# EAGLE design SPI_Test_2xMCUs (EAGLE 9.6.2)
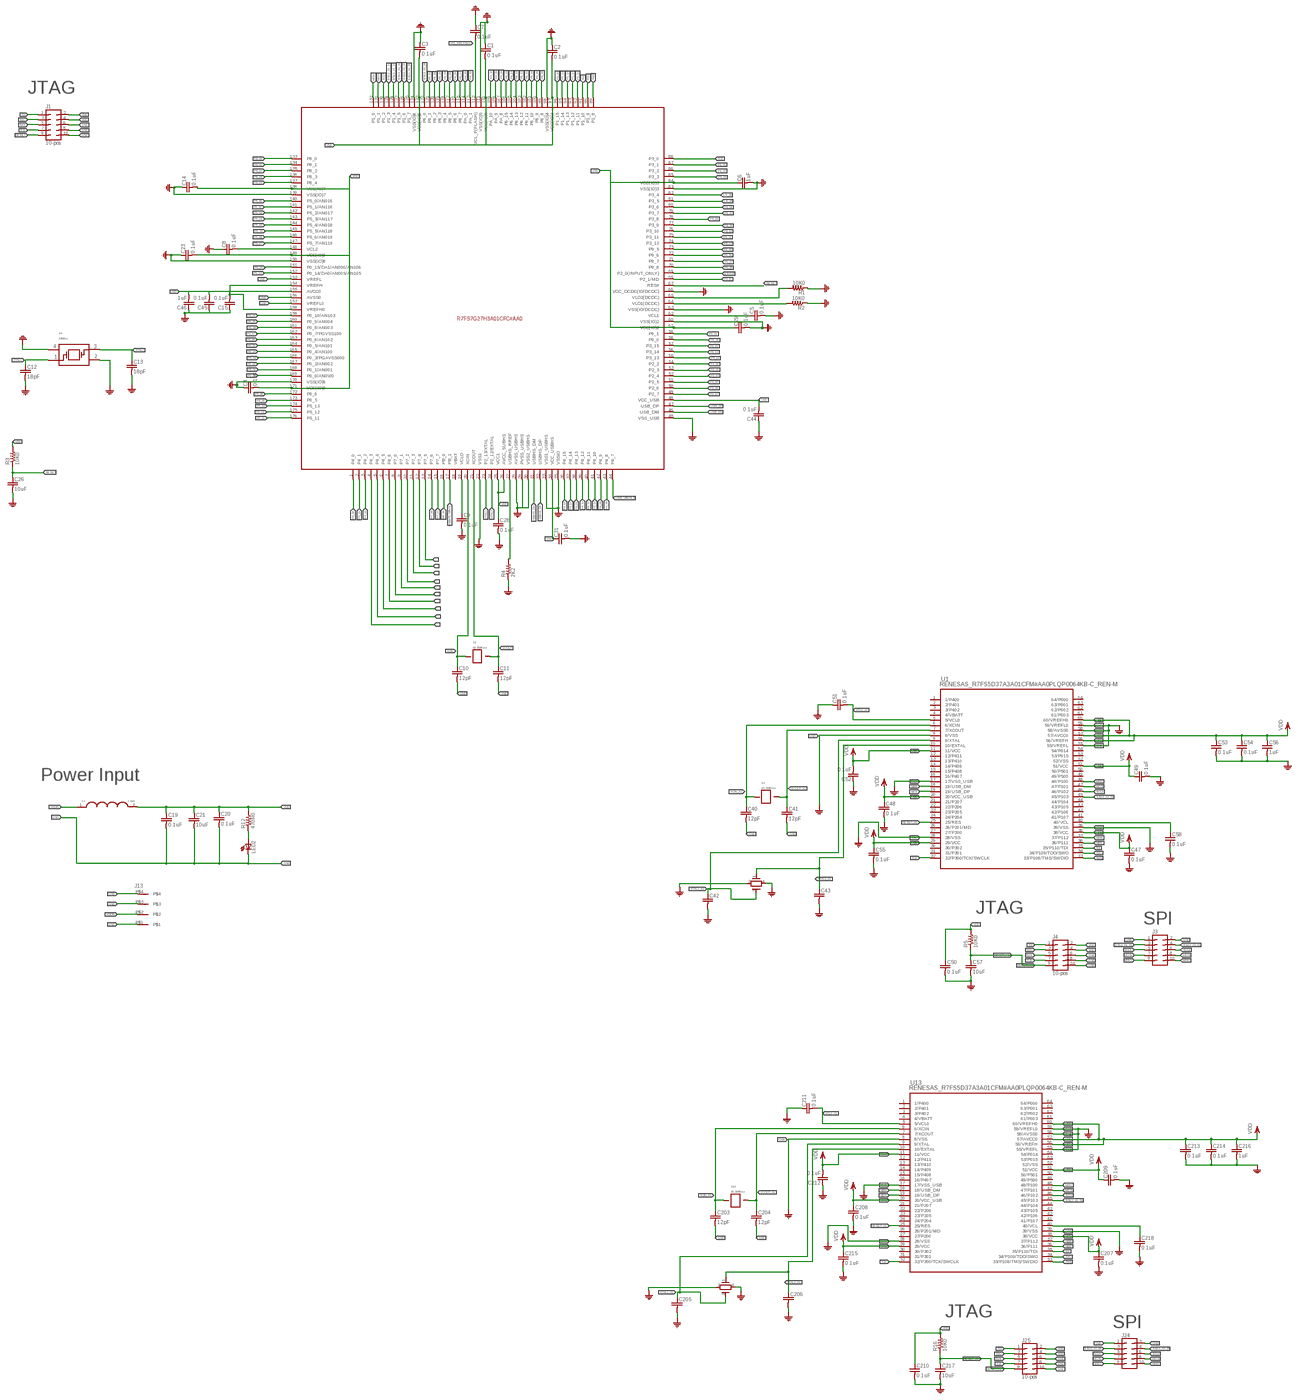
[diagram p0: schematic, sheet 1, overview]
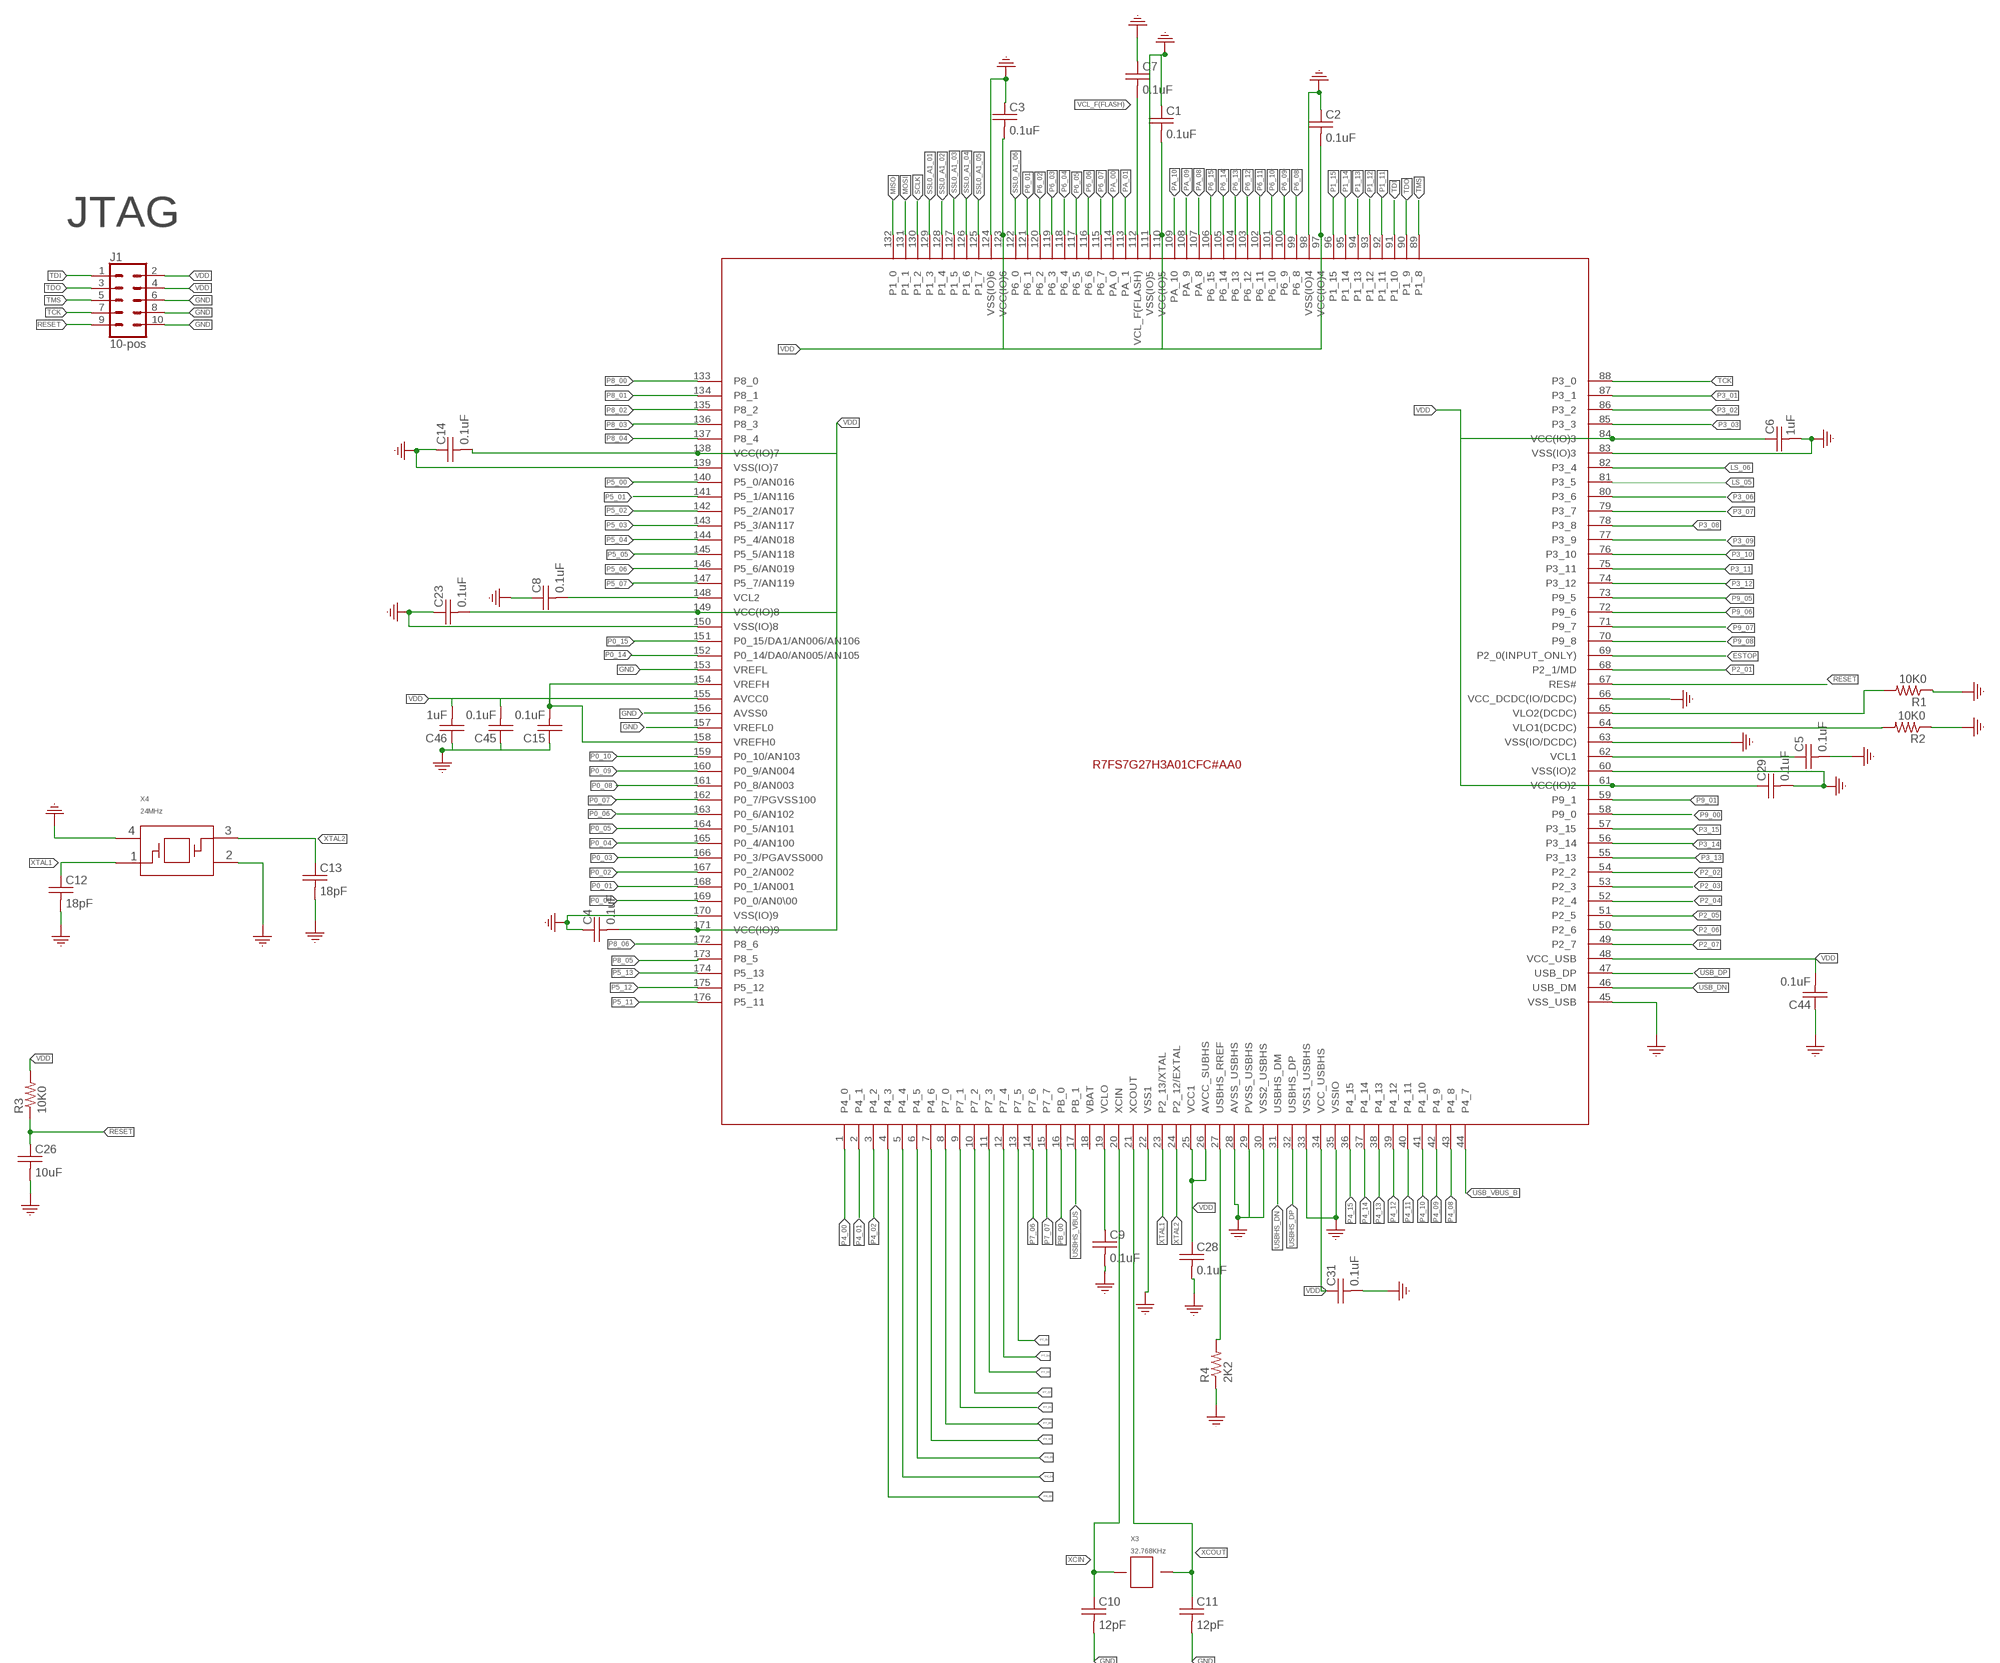
[diagram p1: schematic, sheet 1, part 1 of 4]
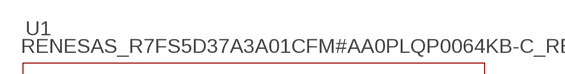
[diagram p2: schematic, sheet 1, part 2 of 4]
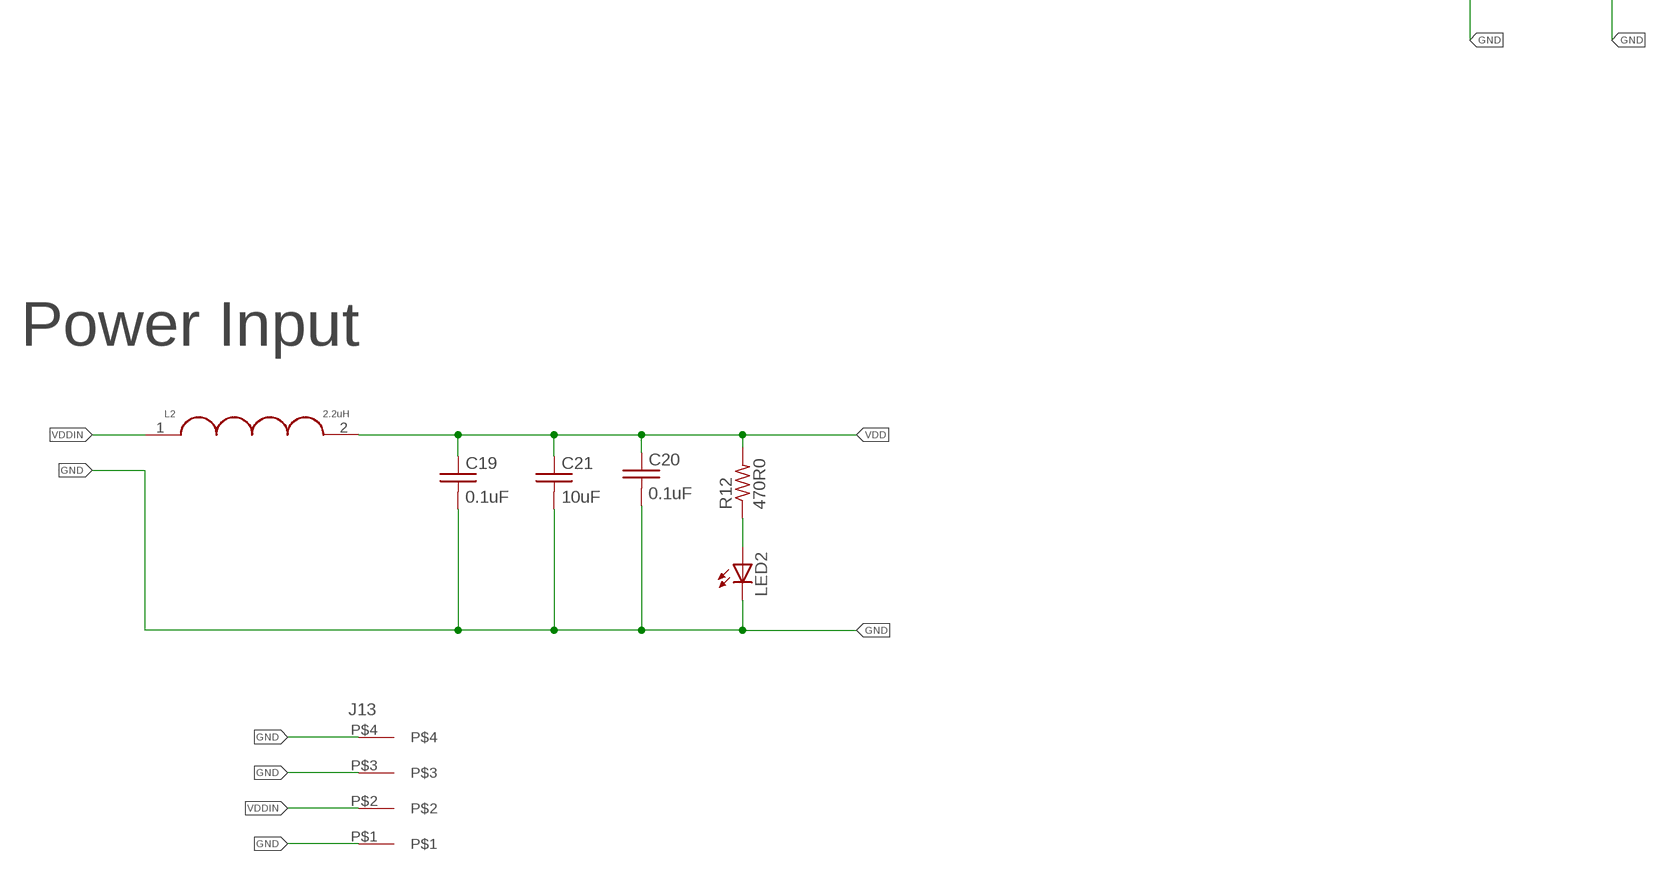
[diagram p3: schematic, sheet 1, part 3 of 4]
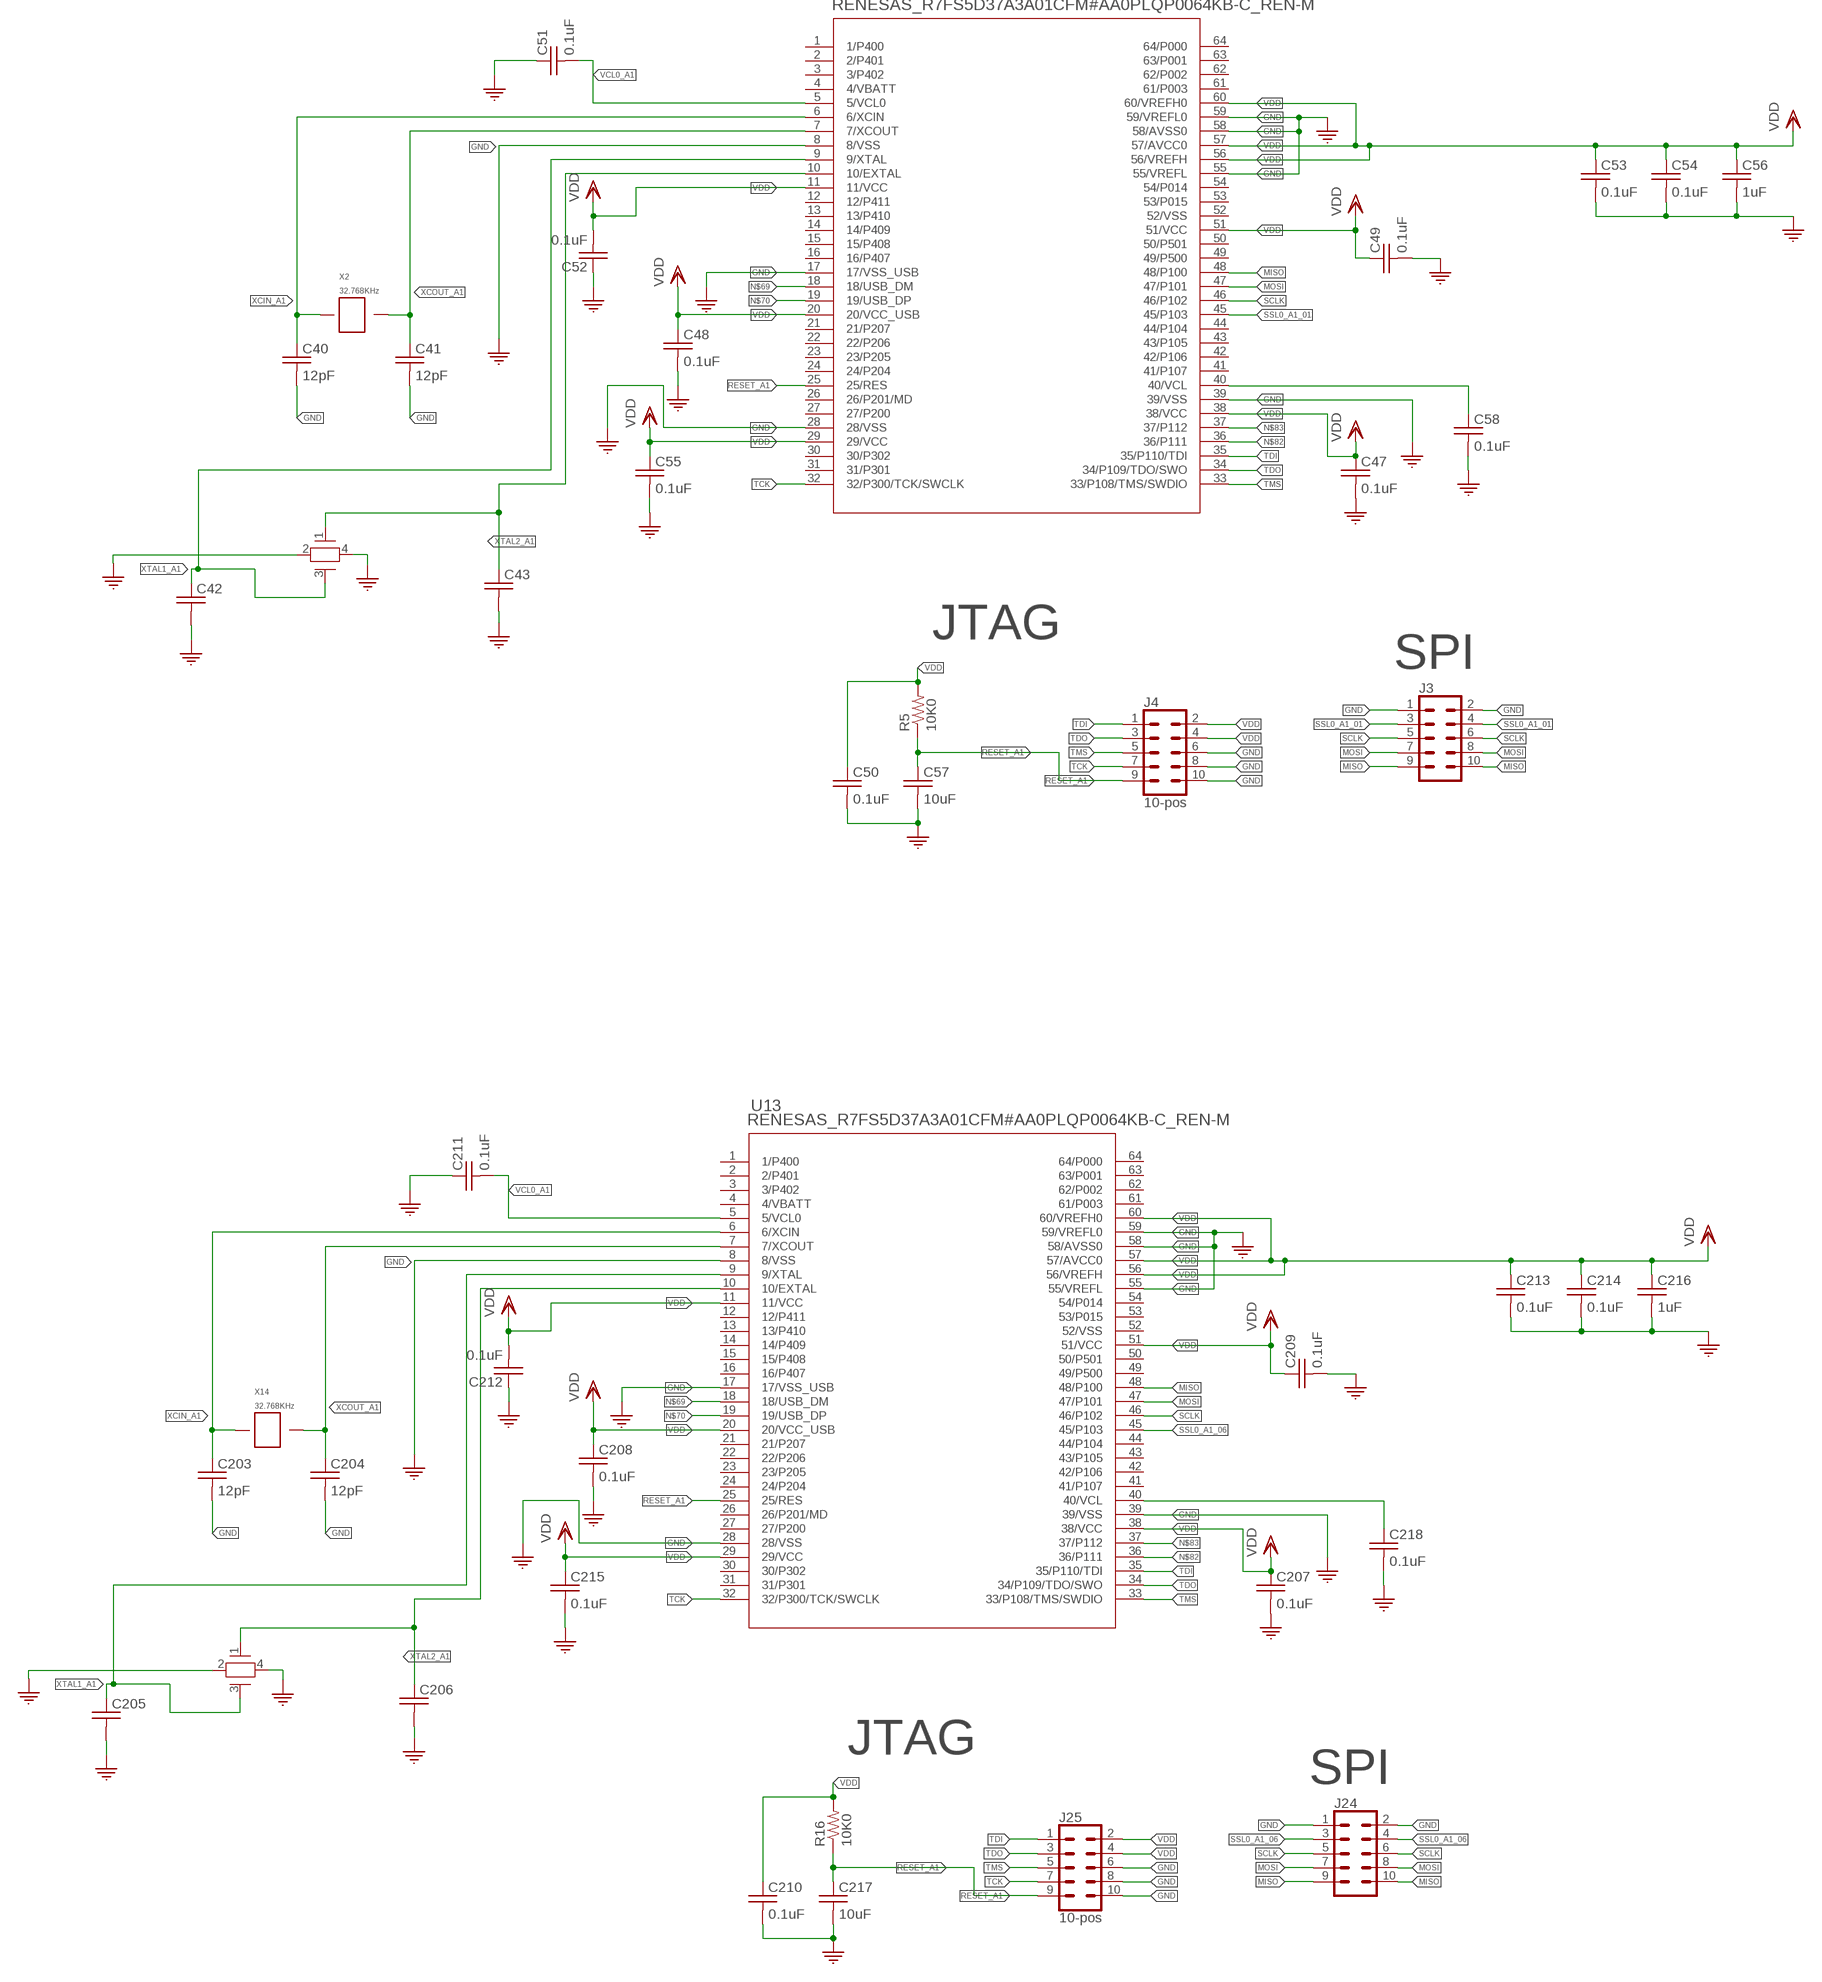
[diagram p4: schematic, sheet 1, part 4 of 4]

## Parts
C1  0.1uF  C_0402_0.1UF  [0402]
C2  0.1uF  C_0402_0.1UF  [0402]
C3  0.1uF  C_0402_0.1UF  [0402]
C4  0.1uF  C_0402_0.1UF  [0402]
C5  0.1uF  C_0402_0.1UF  [0402]
C6  1uF  C_0402_1UF  [0402]
C7  0.1uF  C_0402_0.1UF  [0402]
C8  0.1uF  C_0402_0.1UF  [0402]
C9  0.1uF  C_0402_0.1UF  [0402]
C10  12pF  C_0402_12PF  [0402]
C11  12pF  C_0402_12PF  [0402]
C12  18pF  C_0402_18PF  [0402]
C13  18pF  C_0402_18PF  [0402]
C14  0.1uF  C_0402_0.1UF  [0402]
C15  0.1uF  C_0402_0.1UF  [0402]
C19  0.1uF  C_0402_0.1UF  [0402]
C20  0.1uF  C_0402_0.1UF  [0402]
C21  10uF  C_0402_10UF  [0402]
C23  0.1uF  C_0402_0.1UF  [0402]
C26  10uF  C_0402_10UF  [0402]
C28  0.1uF  C_0402_0.1UF  [0402]
C29  0.1uF  C_0402_0.1UF  [0402]
C31  0.1uF  C_0402_0.1UF  [0402]
C40  12pF  C_0402_12PF  [0402]
C41  12pF  C_0402_12PF  [0402]
C42  10pF  C_0402_10PF  [0402]
C43  10pF  C_0402_10PF  [0402]
C44  0.1uF  C_0402_0.1UF  [0402]
C45  0.1uF  C_0402_0.1UF  [0402]
C46  1uF  C_0402_1UF  [0402]
C47  0.1uF  C_0402_0.1UF  [0402]
C48  0.1uF  C_0402_0.1UF  [0402]
C49  0.1uF  C_0402_0.1UF  [0402]
C50  0.1uF  C_0402_0.1UF  [0402]
C51  0.1uF  C_0402_0.1UF  [0402]
C52  0.1uF  C_0402_0.1UF  [0402]
C53  0.1uF  C_0402_0.1UF  [0402]
C54  0.1uF  C_0402_0.1UF  [0402]
C55  0.1uF  C_0402_0.1UF  [0402]
C56  1uF  C_0402_1UF  [0402]
C57  10uF  C_0402_10UF  [0402]
C58  0.1uF  C_0402_0.1UF  [0402]
C203  12pF  C_0402_12PF  [0402]
C204  12pF  C_0402_12PF  [0402]
C205  10pF  C_0402_10PF  [0402]
C206  10pF  C_0402_10PF  [0402]
C207  0.1uF  C_0402_0.1UF  [0402]
C208  0.1uF  C_0402_0.1UF  [0402]
C209  0.1uF  C_0402_0.1UF  [0402]
C210  0.1uF  C_0402_0.1UF  [0402]
C211  0.1uF  C_0402_0.1UF  [0402]
C212  0.1uF  C_0402_0.1UF  [0402]
C213  0.1uF  C_0402_0.1UF  [0402]
C214  0.1uF  C_0402_0.1UF  [0402]
C215  0.1uF  C_0402_0.1UF  [0402]
C216  1uF  C_0402_1UF  [0402]
C217  10uF  C_0402_10UF  [0402]
C218  0.1uF  C_0402_0.1UF  [0402]
J1  10-pos  CONN_05X2_RAPTH  [2X5]
J3  CONN_05X2PTH  [2X5]
J4  10-pos  CONN_05X2_RAPTH  [2X5]
J13  4-pos  3.81MM_1_X_4_RT_ANGLE_PLUG_HEADER  [1X4_3.81MM_PITCH]
J24  CONN_05X2PTH  [2X5]
J25  10-pos  CONN_05X2_RAPTH  [2X5]
L2  2.2uH  INDUCTOR_1008_2.2_MH_1.3A  [1008]
LED2  Green  LED_0805_GREEN  [0805]
R1  10K0  R_0402_10K0  [0402]
R2  10K0  R_0402_10K0  [0402]
R3  10K0  R_0402_10K0  [0402]
R4  2K2  R_0402_2K2  [0402]
R5  10K0  R_0402_10K0  [0402]
R12  470R0  R_0402_470R0  [0402]
R16  10K0  R_0402_10K0  [0402]
U1  RENESAS_R7FS5D37A3A01CFM#AA0PLQP0064KB-C_REN-M  [PLQP0064KB-C_REN-M]
U2  S7G2LQFP176  RENESAS_S7G2_X_176  [LQFP176_24X24]
U13  RENESAS_R7FS5D37A3A01CFM#AA0PLQP0064KB-C_REN-M  [PLQP0064KB-C_REN-M]
X2  32.768KHz  XTAL_32.768KHZ  [SMD_X_2_PADS]
X3  32.768KHz  XTAL_32.768KHZ  [SMD_X_2_PADS]
X4  24MHz  XTAL_24_MHZ  [SMD_3225]
X14  32.768KHz  XTAL_32.768KHZ  [SMD_X_2_PADS]
Y1  XTAL_12MHZ_ABM8G-12.000MHZ-B4Y-T  [CRYSTAL_ABM8G_ABR]
Y12  XTAL_12MHZ_ABM8G-12.000MHZ-B4Y-T  [CRYSTAL_ABM8G_ABR]

## Nets
ESTOP: U2.69(P2_0(INPUT_ONLY))
GND: C1.P$1 C2.P$1 C3.P$1 C4.P$1 C5.P$2 C6.P$2 C7.P$1 C8.P$1 C9.P$2 C10.P$2 C11.P$2 C12.P$2 C13.P$2 C14.P$1 C15.P$1 C19.P$2 C20.P$2 C21.P$2 C23.P$1 C26.P$2 C28.P$2 C29.P$2 C31.P$2 C40.P$2 C41.P$2 C42.P$2 C43.P$2 C44.P$1 C45.P$1 C46.P$1 C47.P$2 C48.P$2 C49.P$2 C50.P$2 C51.P$1 C52.P$1 C53.P$2 C54.P$2 C55.P$2 C56.P$2 C57.P$2 C58.P$2 C203.P$2 C204.P$2 C205.P$2 C206.P$2 C207.P$2 C208.P$2 C209.P$2 C210.P$2 C211.P$1 C212.P$1 C213.P$2 C214.P$2 C215.P$2 C216.P$2 C217.P$2 C218.P$2 J1.6 J1.8 J1.10 J3.1 J3.2 J4.6 J4.8 J4.10 J13.P$1 J13.P$3 J13.P$4 J24.1 J24.2 J25.6 J25.8 J25.10 LED2.2(C) R1.P$1 R2.P$1 R4.P$1 U1.8(8/VSS) U1.17(17/VSS_USB) U1.28(28/VSS) U1.39(39/VSS) U1.55(55/VREFL) U1.58(58/AVSS0) U1.59(59/VREFL0) U2.22(VSS1) U2.28(AVSS_USBHS) U2.29(PVSS_USBHS) U2.30(VSS2_USBHS) U2.33(VSS1_USBHS) U2.35(VSSIO) U2.45(VSS_USB) U2.60(VSS(IO)2) U2.63(VSS(IO/DCDC)) U2.66(VCC_DCDC(IO/DCDC)) U2.83(VSS(IO)3) U2.98(VSS(IO)4) U2.111(VSS(IO)5) U2.124(VSS(IO)6) U2.139(VSS(IO)7) U2.150(VSS(IO)8) U2.153(VREFL) U2.156(AVSS0) U2.157(VREFL0) U2.170(VSS(IO)9) U13.8(8/VSS) U13.17(17/VSS_USB) U13.28(28/VSS) U13.39(39/VSS) U13.55(55/VREFL) U13.58(58/AVSS0) U13.59(59/VREFL0) X4.2 X4.4 Y1.2 Y1.4 Y12.2 Y12.4
LS_05: U2.81(P3_5)
LS_06: U2.82(P3_4)
MISO: J3.9 J3.10 J24.9 J24.10 U1.48(48/P100) U2.132(P1_0) U13.48(48/P100)
MOSI: J3.7 J3.8 J24.7 J24.8 U1.47(47/P101) U2.131(P1_1) U13.47(47/P101)
N$2: C8.P$2 U2.148(VCL2)
N$3: C9.P$1 U2.19(VCLO)
N$4: LED2.1(A) R12.P$1
N$5: C58.P$1 U1.40(40/VCL)
N$9: C5.P$1 U2.62(VCL1)
N$10: R2.P$2 U2.64(VLO1(DCDC))
N$11: R1.P$2 U2.65(VLO2(DCDC))
N$12: R4.P$2 U2.27(USBHS_RREF)
N$19: C218.P$1 U13.40(40/VCL)
N$69: U1.18(18/USB_DM) U13.18(18/USB_DM)
N$70: U1.19(19/USB_DP) U13.19(19/USB_DP)
N$82: U1.36(36/P111) U13.36(36/P111)
N$83: U1.37(37/P112) U13.37(37/P112)
P0_00: U2.169(P0_0/AN0\00)
P0_01: U2.168(P0_1/AN001)
P0_02: U2.167(P0_2/AN002)
P0_03: U2.166(P0_3/PGAVSS000)
P0_04: U2.165(P0_4/AN100)
P0_05: U2.164(P0_5/AN101)
P0_06: U2.163(P0_6/AN102)
P0_07: U2.162(P0_7/PGVSS100)
P0_08: U2.161(P0_8/AN003)
P0_09: U2.160(P0_9/AN004)
P0_10: U2.159(P0_10/AN103)
P0_14: U2.152(P0_14/DA0/AN005/AN105)
P0_15: U2.151(P0_15/DA1/AN006/AN106)
P1_11: U2.92(P1_11)
P1_12: U2.93(P1_12)
P1_13: U2.94(P1_13)
P1_14: U2.95(P1_14)
P1_15: U2.96(P1_15)
P2_01: U2.68(P2_1/MD)
P2_02: U2.54(P2_2)
P2_03: U2.53(P2_3)
P2_04: U2.52(P2_4)
P2_05: U2.51(P2_5)
P2_06: U2.50(P2_6)
P2_07: U2.49(P2_7)
P3_01: U2.87(P3_1)
P3_02: U2.86(P3_2)
P3_03: U2.85(P3_3)
P3_06: U2.80(P3_6)
P3_07: U2.79(P3_7)
P3_08: U2.78(P3_8)
P3_09: U2.77(P3_9)
P3_10: U2.76(P3_10)
P3_11: U2.75(P3_11)
P3_12: U2.74(P3_12)
P3_13: U2.55(P3_13)
P3_14: U2.56(P3_14)
P3_15: U2.57(P3_15)
P4_00: U2.1(P4_0)
P4_01: U2.2(P4_1)
P4_02: U2.3(P4_2)
P4_03: U2.4(P4_3)
P4_04: U2.5(P4_4)
P4_05: U2.6(P4_5)
P4_06: U2.7(P4_6)
P4_08: U2.43(P4_8)
P4_09: U2.42(P4_9)
P4_10: U2.41(P4_10)
P4_11: U2.40(P4_11)
P4_12: U2.39(P4_12)
P4_13: U2.38(P4_13)
P4_14: U2.37(P4_14)
P4_15: U2.36(P4_15)
P5_00: U2.140(P5_0/AN016)
P5_01: U2.141(P5_1/AN116)
P5_02: U2.142(P5_2/AN017)
P5_03: U2.143(P5_3/AN117)
P5_04: U2.144(P5_4/AN018)
P5_05: U2.145(P5_5/AN118)
P5_06: U2.146(P5_6/AN019)
P5_07: U2.147(P5_7/AN119)
P5_11: U2.176(P5_11)
P5_12: U2.175(P5_12)
P5_13: U2.174(P5_13)
P6_01: U2.121(P6_1)
P6_02: U2.120(P6_2)
P6_03: U2.119(P6_3)
P6_04: U2.118(P6_4)
P6_05: U2.117(P6_5)
P6_06: U2.116(P6_6)
P6_07: U2.115(P6_7)
P6_08: U2.99(P6_8)
P6_09: U2.100(P6_9)
P6_10: U2.101(P6_10)
P6_11: U2.102(P6_11)
P6_12: U2.103(P6_12)
P6_13: U2.104(P6_13)
P6_14: U2.105(P6_14)
P6_15: U2.106(P6_15)
P7_00: U2.8(P7_0)
P7_01: U2.9(P7_1)
P7_02: U2.10(P7_2)
P7_03: U2.11(P7_3)
P7_04: U2.12(P7_4)
P7_05: U2.13(P7_5)
P7_06: U2.14(P7_6)
P7_07: U2.15(P7_7)
P8_00: U2.133(P8_0)
P8_01: U2.134(P8_1)
P8_02: U2.135(P8_2)
P8_03: U2.136(P8_3)
P8_04: U2.137(P8_4)
P8_05: U2.173(P8_5)
P8_06: U2.172(P8_6)
P9_00: U2.58(P9_0)
P9_01: U2.59(P9_1)
P9_05: U2.73(P9_5)
P9_06: U2.72(P9_6)
P9_07: U2.71(P9_7)
P9_08: U2.70(P9_8)
PA_00: U2.114(PA_0)
PA_01: U2.113(PA_1)
PA_08: U2.107(PA_8)
PA_09: U2.108(PA_9)
PA_10: U2.109(PA_10)
PB_00: U2.16(PB_0)
RESET: C26.P$1 J1.9 R3.P$1 U2.67(RES#)
RESET_A1: C57.P$1 C217.P$1 J4.9 J25.9 R5.P$1 R16.P$1 U1.25(25/RES) U13.25(25/RES)
SCLK: J3.5 J3.6 J24.5 J24.6 U1.46(46/P102) U2.130(P1_2) U13.46(46/P102)
SSL0_A1_01: J3.3 J3.4 U1.45(45/P103) U2.129(P1_3)
SSL0_A1_02: U2.128(P1_4)
SSL0_A1_03: U2.127(P1_5)
SSL0_A1_04: U2.126(P1_6)
SSL0_A1_05: U2.125(P1_7)
SSL0_A1_06: J24.3 J24.4 U2.122(P6_0) U13.45(45/P103)
TCK: J1.7 J4.7 J25.7 U1.32(32/P300/TCK/SWCLK) U2.88(P3_0) U13.32(32/P300/TCK/SWCLK)
TDI: J1.1 J4.1 J25.1 U1.35(35/P110/TDI) U2.91(P1_10) U13.35(35/P110/TDI)
TDO: J1.3 J4.3 J25.3 U1.34(34/P109/TDO/SWO) U2.90(P1_9) U13.34(34/P109/TDO/SWO)
TMS: J1.5 J4.5 J25.5 U1.33(33/P108/TMS/SWDIO) U2.89(P1_8) U13.33(33/P108/TMS/SWDIO)
USB_DN [USB_DIFF_PAIR]: U2.46(USB_DM)
USB_DP [USB_DIFF_PAIR]: U2.47(USB_DP)
USB_VBUS_B: U2.44(P4_7)
USBHS_DN: U2.31(USBHS_DM)
USBHS_DP: U2.32(USBHS_DP)
USBHS_VBUS: U2.17(PB_1)
VCL0_A1: C51.P$2 C211.P$2 U1.5(5/VCL0) U13.5(5/VCL0)
VCL_F(FLASH): C7.P$2 U2.112(VCL_F(FLASH))
VDD: C1.P$2 C2.P$2 C3.P$2 C4.P$2 C6.P$1 C14.P$2 C15.P$2 C19.P$1 C20.P$1 C21.P$1 C23.P$2 C28.P$1 C29.P$1 C31.P$1 C44.P$2 C45.P$2 C46.P$2 C47.P$1 C48.P$1 C49.P$1 C50.P$1 C52.P$2 C53.P$1 C54.P$1 C55.P$1 C56.P$1 C207.P$1 C208.P$1 C209.P$1 C210.P$1 C212.P$2 C213.P$1 C214.P$1 C215.P$1 C216.P$1 J1.2 J1.4 J4.2 J4.4 J25.2 J25.4 L2.2 R3.P$2 R5.P$2 R12.P$2 R16.P$2 U1.11(11/VCC) U1.20(20/VCC_USB) U1.29(29/VCC) U1.38(38/VCC) U1.51(51/VCC) U1.56(56/VREFH) U1.57(57/AVCC0) U1.60(60/VREFH0) U2.25(VCC1) U2.26(AVCC_SUBHS) U2.34(VCC_USBHS) U2.48(VCC_USB) U2.61(VCC(IO)2) U2.84(VCC(IO)3) U2.97(VCC(IO)4) U2.110(VCC(IO)5) U2.123(VCC(IO)6) U2.138(VCC(IO)7) U2.149(VCC(IO)8) U2.154(VREFH) U2.155(AVCC0) U2.158(VREFH0) U2.171(VCC(IO)9) U13.11(11/VCC) U13.20(20/VCC_USB) U13.29(29/VCC) U13.38(38/VCC) U13.51(51/VCC) U13.56(56/VREFH) U13.57(57/AVCC0) U13.60(60/VREFH0)
VDDIN: J13.P$2 L2.1
XCIN: C10.P$1 U2.20(XCIN) X3.P$1
XCIN_A1: C40.P$1 C203.P$1 U1.6(6/XCIN) U13.6(6/XCIN) X2.P$1 X14.P$1
XCOUT: C11.P$1 U2.21(XCOUT) X3.P$2
XCOUT_A1: C41.P$1 C204.P$1 U1.7(7/XCOUT) U13.7(7/XCOUT) X2.P$2 X14.P$2
XTAL1: C12.P$1 U2.23(P2_13/XTAL) X4.1
XTAL1_A1: C42.P$1 C205.P$1 U1.9(9/XTAL) U13.9(9/XTAL) Y1.3 Y12.3
XTAL2: C13.P$1 U2.24(P2_12/EXTAL) X4.3
XTAL2_A1: C43.P$1 C206.P$1 U1.10(10/EXTAL) U13.10(10/EXTAL) Y1.1 Y12.1
Unconnected: U1.1(1/P400) U1.2(2/P401) U1.3(3/P402) U1.12(12/P411) U1.13(13/P410) U1.14(14/P409) U1.15(15/P408) U1.16(16/P407) U1.22(22/P206) U1.23(23/P205) U1.24(24/P204) U1.26(26/P201/MD) U1.27(27/P200) U1.30(30/P302) U1.31(31/P301) U1.41(41/P107) U1.42(42/P106) U1.43(43/P105) U1.44(44/P104) U1.49(49/P500) U1.50(50/P501) U1.52(52/VSS) U1.53(53/P015) U1.54(54/P014) U1.61(61/P003) U1.62(62/P002) U1.63(63/P001) U1.64(64/P000) U2.18(VBAT) U13.1(1/P400) U13.2(2/P401) U13.3(3/P402) U13.12(12/P411) U13.13(13/P410) U13.14(14/P409) U13.15(15/P408) U13.16(16/P407) U13.22(22/P206) U13.23(23/P205) U13.24(24/P204) U13.26(26/P201/MD) U13.27(27/P200) U13.30(30/P302) U13.31(31/P301) U13.41(41/P107) U13.42(42/P106) U13.43(43/P105) U13.44(44/P104) U13.49(49/P500) U13.50(50/P501) U13.52(52/VSS) U13.53(53/P015) U13.54(54/P014) U13.61(61/P003) U13.62(62/P002) U13.63(63/P001) U13.64(64/P000)

## Notes on the sheet
- JTAG
- Power Input
- JTAG
- SPI
- JTAG
- SPI

## Power pins joined to a net without a drawn wire
4/VBATT: U1.4(4/VBATT) U13.4(4/VBATT)
21/P207: U1.21(21/P207) U13.21(21/P207)

## Library data of the parts
C1-C5 C7-C9 C14 C15 C19 C20 C23 C28 C29 C31 C44 C45 C47-C55 C58 C207-C215 C218 = 3D_MIG_Controller:C_0402_0.1UF; PARTNO: CL05F104ZO5NNNC
C6 C46 C56 C216 = 3D_MIG_Controller:C_0402_1UF; PARTNO: CL05A105KO5NNNC
C10 C11 C40 C41 C203 C204 = 3D_MIG_Controller:C_0402_12PF; PARTNO: CL05C120JB5NNNC
C12 C13 = 3D_MIG_Controller:C_0402_18PF; PARTNO: UMK105CG180JV-F
C21 C26 C57 C217 = 3D_MIG_Controller:C_0402_10UF; PARTNO: CL05A106MP8NUB8
C42 C43 C205 C206 = 3D_MIG_Controller:C_0402_10PF; PARTNO: CC0402JRNPO9BN100
J1 J4 J25 = 3D_MIG_Controller:CONN_05X2_RA: Connector Header Through Hole, Right Angle 10 position 0.100" (2.54mm); PARTNO: PH2RA-10-UA
J3 J24 = 3D_MIG_Controller:CONN_05X2: Multi connection point. Often used as Generic Header-pin footprint for 0.1 inch spaced/style header connections For AVR SPI programming port, see special device with nice symbol: "AVR_SPI_PROG_5x2.dev" You can populate with any combo of single row headers, but if you'd like an exact match, check these: 2x5 AVR ICSP Male Header <https://www.sparkfun.com/products/778> (PRT-00778) 2x5 Pin Shrouded Header <https://www.sparkfun.com/products/8506> (PRT-08506) On any of the 0.1 inch spaced packages, you can populate with these: Break Away Headers - Straight <https://www.sparkfun.com/products/116> (PRT-00116) Break Away Male Headers - Right Angle <https://www.sparkfun.com/products/553> (PRT-00553) Female Headers <https://www.sparkfun.com/products/115> (PRT-00115) Break Away Headers - Machine Pin <https://www.sparkfun.com/products/117> (PRT-00117) Break Away Female Headers - Swiss Machine Pin <https://www.sparkfun.com/products/743> (PRT-00743) Special note: the shrouded connector mates well with our 5x2 ribbon cables: 2x5 Pin IDC Ribbon Cable <https://www.sparkfun.com/products/8535> (PRT-08535); PROD_ID: CONN-08499; SF_ID: PRT-0778
J13 = 3D_MIG_Controller:3.81MM_1_X_4_RT_ANGLE_PLUG_HEADER: 4 Position Terminal Block Header, Male Pins, Shrouded (4 Side) 0.150" (3.81mm) 90°, Right Angle - Through Hole; PARTNO: 691322310004
L2 = 3D_MIG_Controller:INDUCTOR_1008_2.2_MH_1.3A; PARTNO: LQM2HPN2R2MG0L
LED2 = 3D_MIG_Controller:LED_0805_GREEN: Green 570nm LED Indication - Discrete 2.2V 0805 (2012 Metric); PARTNO: LG R971-KN-1
R1-R3 R5 R16 = 3D_MIG_Controller:R_0402_10K0; PARTNO: RMCF0402JT10K0
R4 = 3D_MIG_Controller:R_0402_2K2; PARTNO: RMCF0402JT2K20
R12 = 3D_MIG_Controller:R_0402_470R0; PARTNO: RMCF0402JT470R
U1 U13 = 3D_MIG_Controller:RENESAS_R7FS5D37A3A01CFM#AA0; COPYRIGHT: Copyright (C) 2023 Ultra Librarian. All rights reserved.; MFR_NAME: Renesas Electronics; PARTNO: R7FS3A37A3A01CFM#AA0
U2 = 3D_MIG_Controller:RENESAS_S7G2_X_176; PARTNO: R7FS7G27H3A01CFC#AA0
X2 X3 X14 = 3D_MIG_Controller:XTAL_32.768KHZ; PARTNO: ABS07-32.768KHZ-T
X4 = 3D_MIG_Controller:XTAL_24_MHZ; PARTNO: FA-238 24.0000MB-C3
Y1 Y12 = 3D_MIG_Controller:XTAL_12MHZ_ABM8G-12.000MHZ-B4Y-T; COPYRIGHT: Copyright (C) 2023 Ultra Librarian. All rights reserved.; MFR_NAME: Abracon; PARTNO: ABM8G-12.000MHZ-B4Y-T

## Board
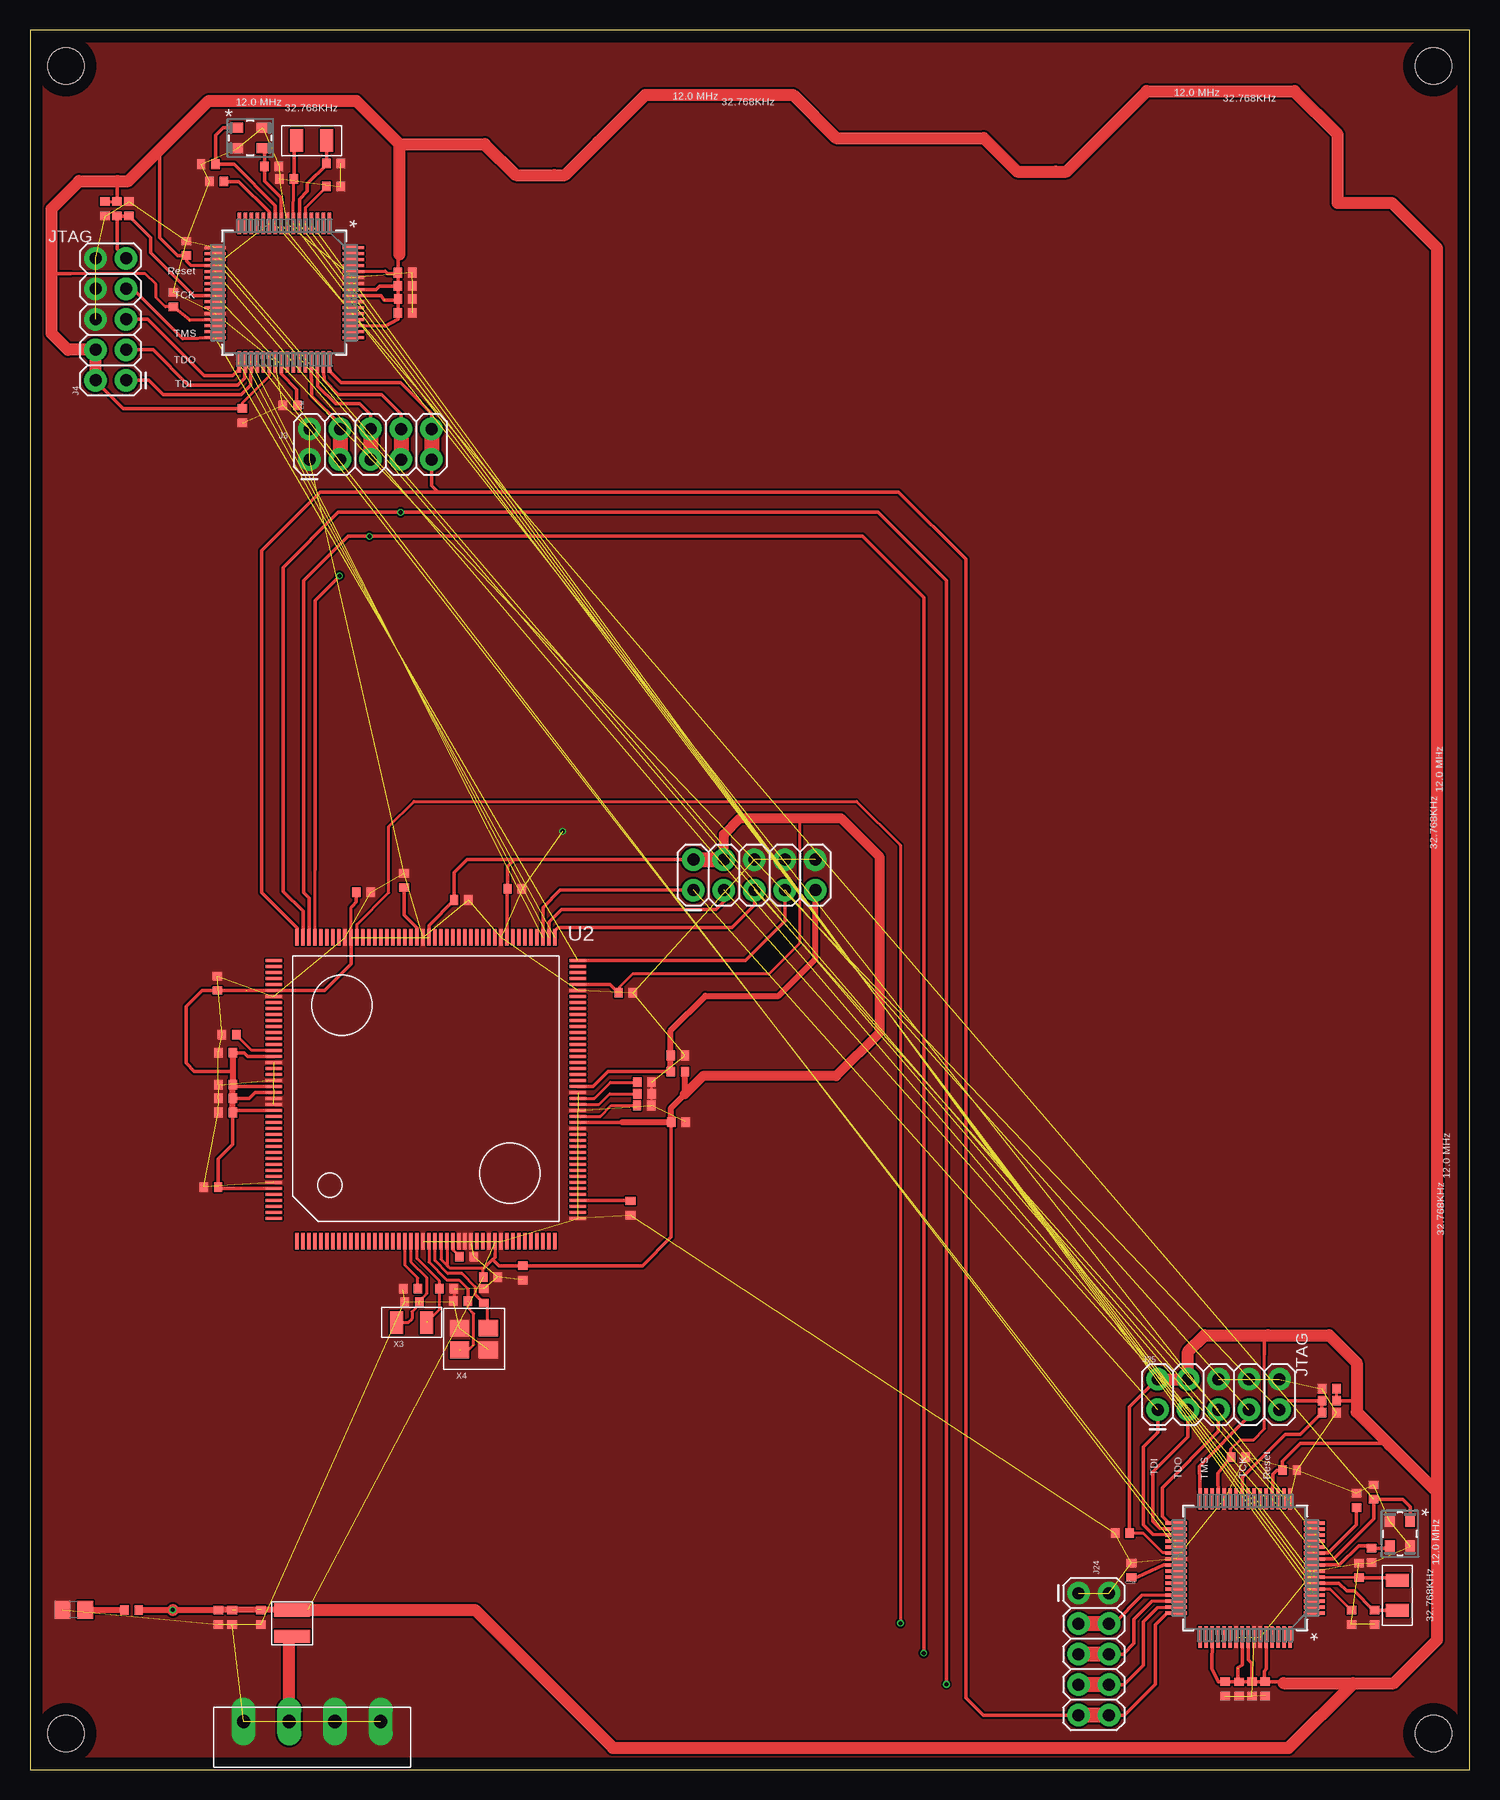
[diagram p5: board, top side]
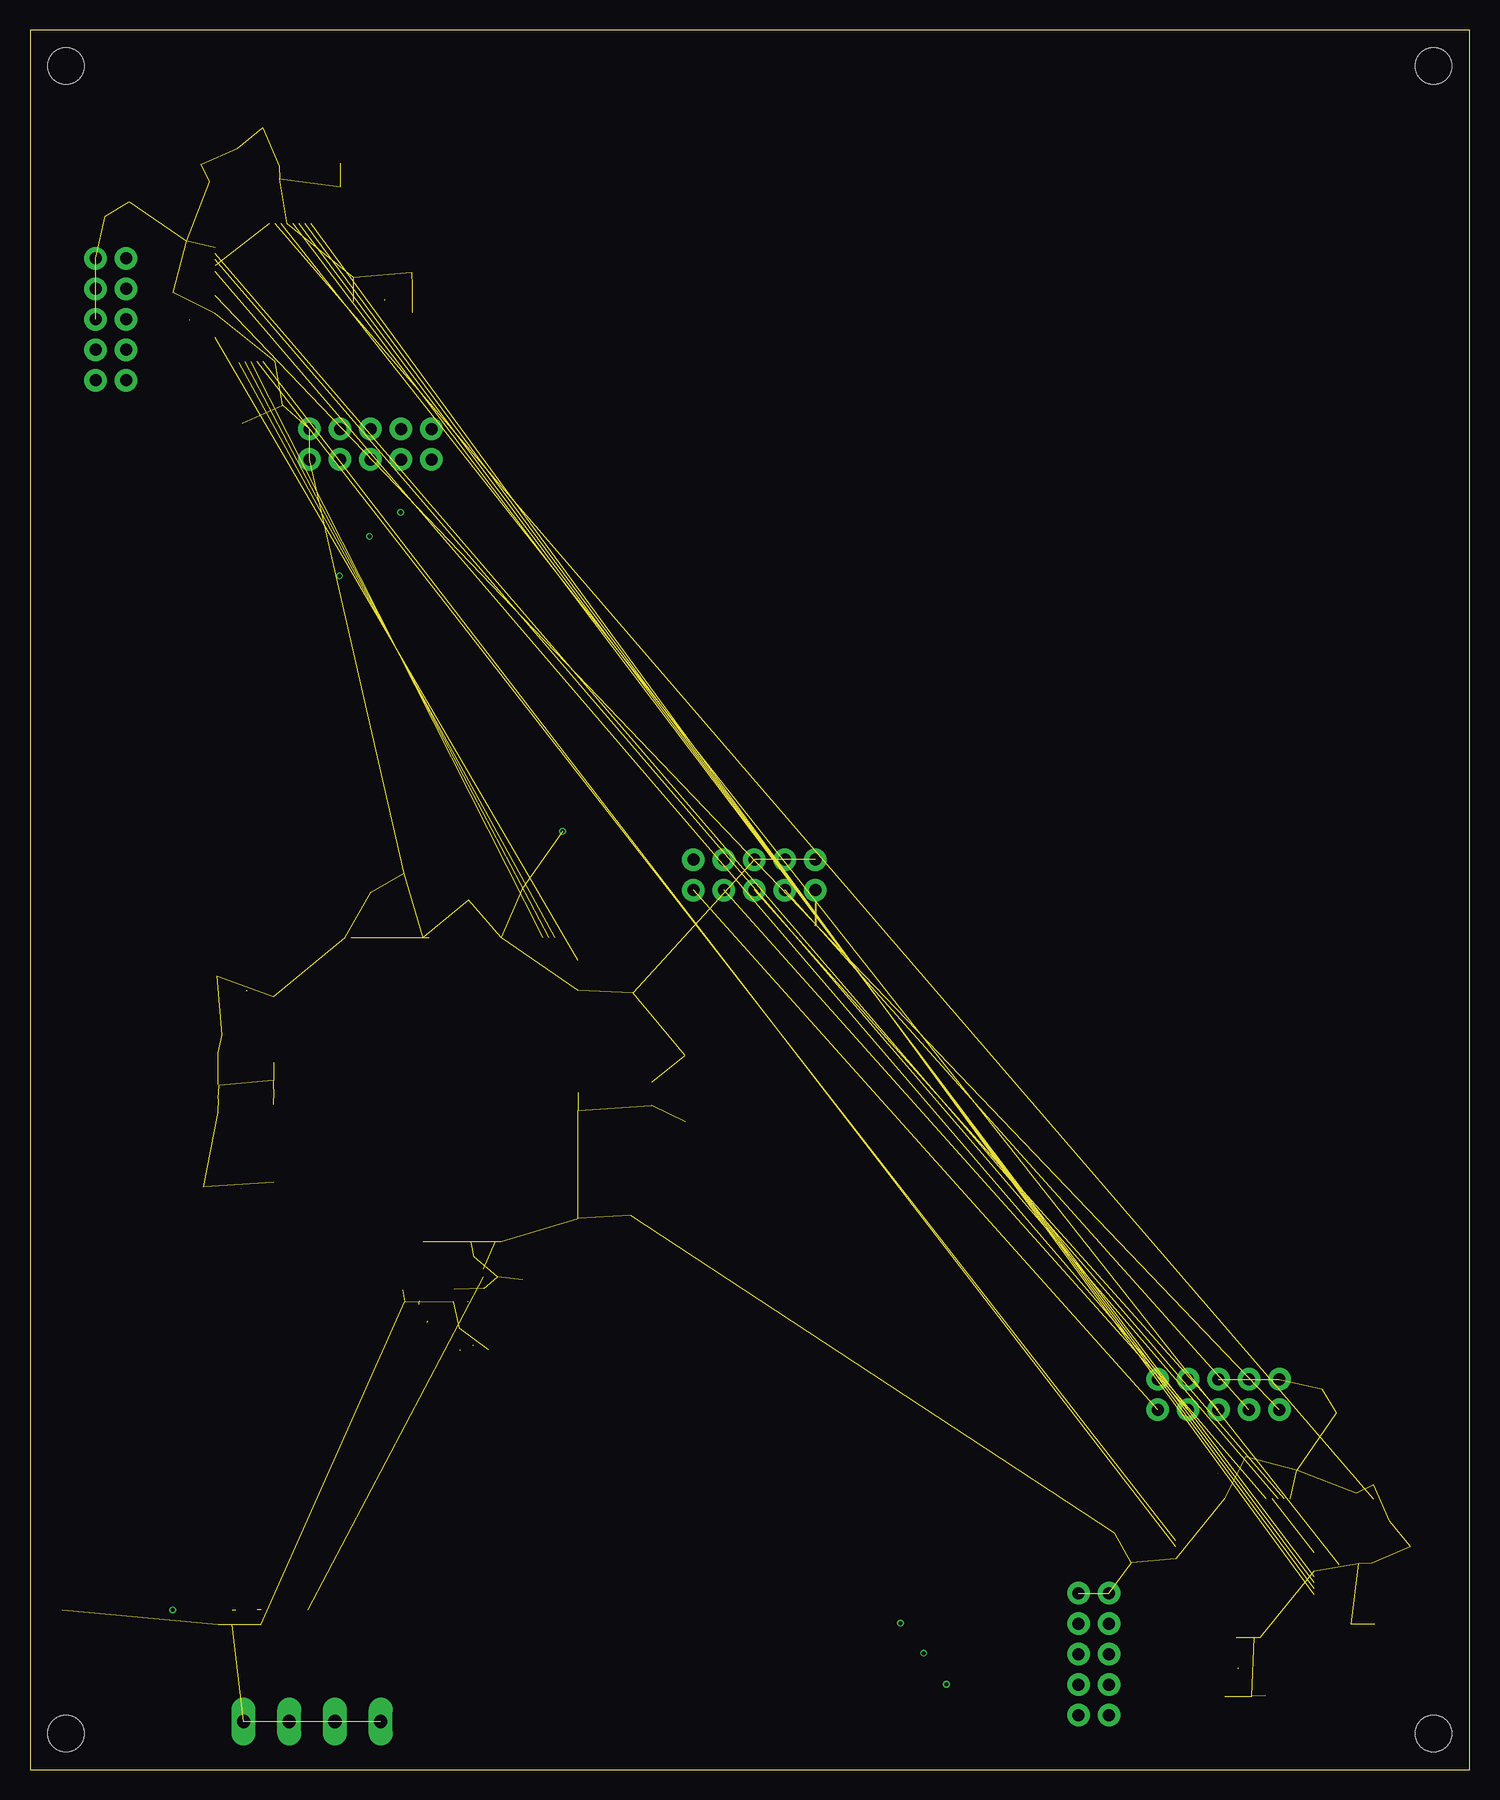
[diagram p6: board, inner layer Route3]
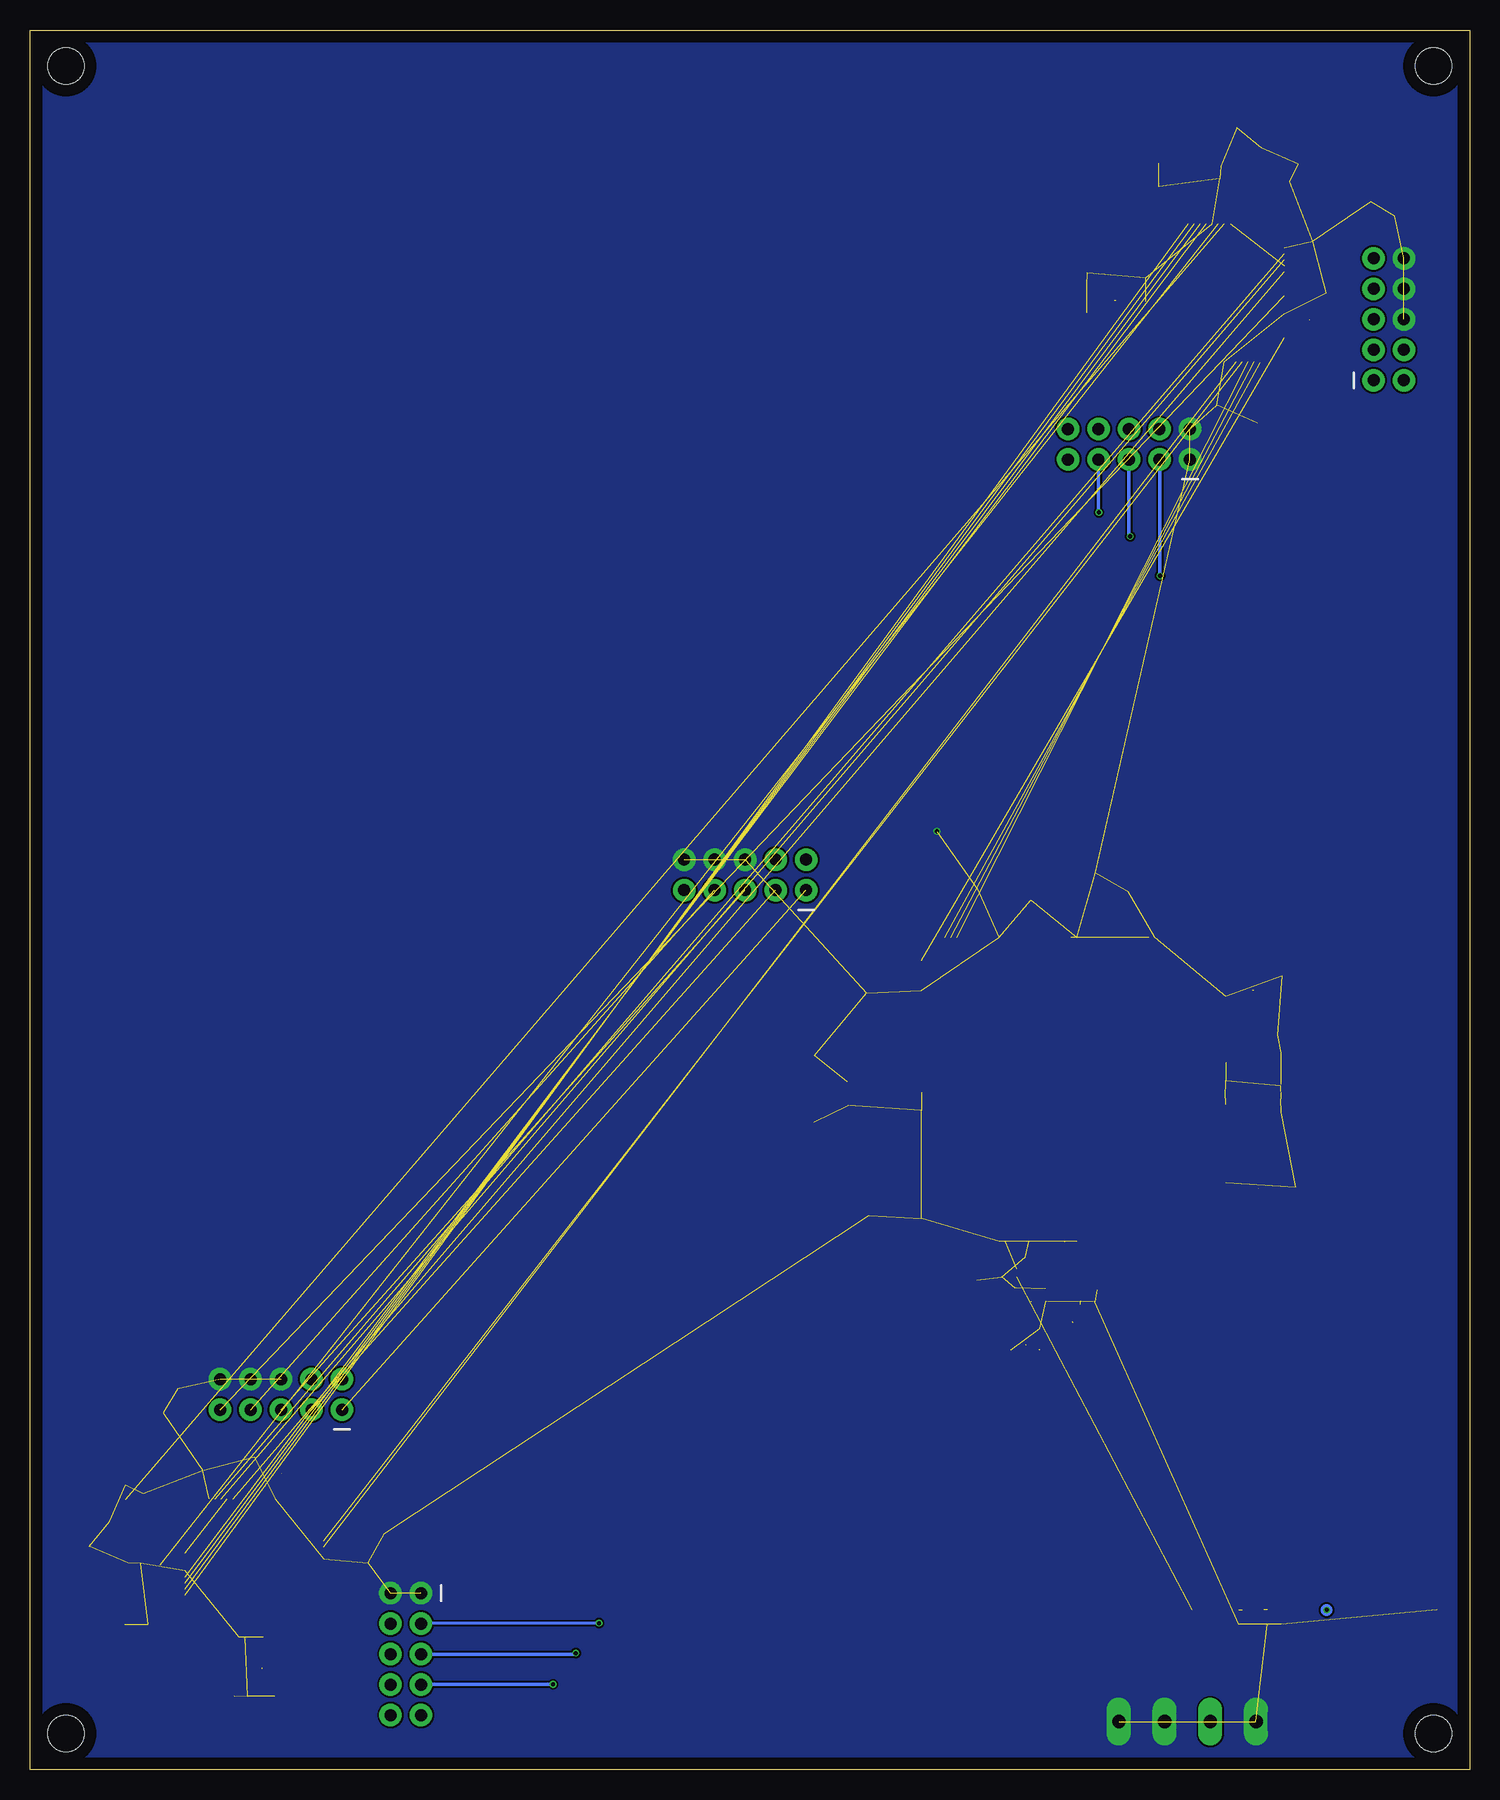
[diagram p7: board, bottom side, seen from below]

Size 120 x 145 mm. Coordinates in mm from the lower left corner, seen from the top.
Outline: 0,0 120,0 120,145 0,145 0,0
Copper layers (1*16): Top 0.035mm / dielectric 1.5mm / Bottom 0.035mm
Design rules "default": minimum track width 6mil, minimum drill 0.2mm, track to track 6mil, track to pad 6mil, pad to pad 6mil, via to via 6mil, smd to smd 6mil, copper to edge 40mil, drill to drill 6mil, minimum pad ring 10mil, minimum via ring 4mil, stop-mask expansion 4mil, vias tented up to drill 0mil, thermal gap 10mil
Holes 3 mm at 3,3 117,3 117,142 3,142

### Footprints (pad centres in the part's own frame; a part is rotated, then mirrored left to right if it is on the bottom)
0402 = smd 0.8 x 0.7: P$1 0,0.6; P$2 0,-0.6
2X5 = drill 1 pad 1.88: 1 0,0; 2 0,2.54; 3 2.54,0; 4 2.54,2.54; 5 5.08,0; 6 5.08,2.54; 7 7.62,0; 8 7.62,2.54; 9 10.16,0; 10 10.16,2.54
1X4_3.81MM_PITCH = drill 1.1 pad 2 long: P$1 0,0; P$2 3.81,0; P$3 7.62,0; P$4 11.43,0
1008 = smd 3 x 1.1: 1 0,1.1; 2 0,-1.1
0805 = smd 1.3 x 1.5: 1 -0.95,0; 2 0.95,0
PLQP0064KB-C_REN-M = smd 1.778 x 0.279: 1 -5.766,3.75; 2 -5.766,3.25; 3 -5.766,2.75; 4 -5.766,2.25; 5 -5.766,1.75; 6 -5.766,1.25; 7 -5.766,0.75; 8 -5.766,0.25; 9 -5.766,-0.25; 10 -5.766,-0.75; 11 -5.766,-1.25; 12 -5.766,-1.75; 13 -5.766,-2.25; 14 -5.766,-2.75; 15 -5.766,-3.25; 16 -5.766,-3.75; 33 5.766,-3.75; 34 5.766,-3.25; 35 5.766,-2.75; 36 5.766,-2.25; 37 5.766,-1.75; 38 5.766,-1.25; 39 5.766,-0.75; 40 5.766,-0.25; 41 5.766,0.25; 42 5.766,0.75; 43 5.766,1.25; 44 5.766,1.75; 45 5.766,2.25; 46 5.766,2.75; 47 5.766,3.25; 48 5.766,3.75 | smd 0.279 x 1.778: 17 -3.75,-5.766; 18 -3.25,-5.766; 19 -2.75,-5.766; 20 -2.25,-5.766; 21 -1.75,-5.766; 22 -1.25,-5.766; 23 -0.75,-5.766; 24 -0.25,-5.766; 25 0.25,-5.766; 26 0.75,-5.766; 27 1.25,-5.766; 28 1.75,-5.766; 29 2.25,-5.766; 30 2.75,-5.766; 31 3.25,-5.766; 32 3.75,-5.766; 49 3.75,5.766; 50 3.25,5.766; 51 2.75,5.766; 52 2.25,5.766; 53 1.75,5.766; 54 1.25,5.766; 55 0.75,5.766; 56 0.25,5.766; 57 -0.25,5.766; 58 -0.75,5.766; 59 -1.25,5.766; 60 -1.75,5.766; 61 -2.25,5.766; 62 -2.75,5.766; 63 -3.25,5.766; 64 -3.75,5.766
LQFP176_24X24 = smd 1.372 x 0.254: 1 -12.675,10.75; 2 -12.675,10.25; 3 -12.675,9.75; 4 -12.675,9.25; 5 -12.675,8.75; 6 -12.675,8.25; 7 -12.675,7.75; 8 -12.675,7.25; 9 -12.675,6.75; 10 -12.675,6.25; 11 -12.675,5.75; 12 -12.675,5.25; 13 -12.675,4.75; 14 -12.675,4.25; 15 -12.675,3.75; 16 -12.675,3.25; 17 -12.675,2.75; 18 -12.675,2.25; 19 -12.675,1.75; 20 -12.675,1.25; 21 -12.675,0.75; 22 -12.675,0.25; 23 -12.675,-0.25; 24 -12.675,-0.75; 25 -12.675,-1.25; 26 -12.675,-1.75; 27 -12.675,-2.25; 28 -12.675,-2.75; 29 -12.675,-3.25; 30 -12.675,-3.75; 31 -12.675,-4.25; 32 -12.675,-4.75; 33 -12.675,-5.25; 34 -12.675,-5.75; 35 -12.675,-6.25; 36 -12.675,-6.75; 37 -12.675,-7.25; 38 -12.675,-7.75; 39 -12.675,-8.25; 40 -12.675,-8.75; 41 -12.675,-9.25; 42 -12.675,-9.75; 43 -12.675,-10.25; 44 -12.675,-10.75; 89 12.675,-10.75; 90 12.675,-10.25; 91 12.675,-9.75; 92 12.675,-9.25; 93 12.675,-8.75; 94 12.675,-8.25; 95 12.675,-7.75; 96 12.675,-7.25; 97 12.675,-6.75; 98 12.675,-6.25; 99 12.675,-5.75; 100 12.675,-5.25; 101 12.675,-4.75; 102 12.675,-4.25; 103 12.675,-3.75; 104 12.675,-3.25; 105 12.675,-2.75; 106 12.675,-2.25; 107 12.675,-1.75; 108 12.675,-1.25; 109 12.675,-0.75; 110 12.675,-0.25; 111 12.675,0.25; 112 12.675,0.75; 113 12.675,1.25; 114 12.675,1.75; 115 12.675,2.25; 116 12.675,2.75; 117 12.675,3.25; 118 12.675,3.75; 119 12.675,4.25; 120 12.675,4.75; 121 12.675,5.25; 122 12.675,5.75; 123 12.675,6.25; 124 12.675,6.75; 125 12.675,7.25; 126 12.675,7.75; 127 12.675,8.25; 128 12.675,8.75; 129 12.675,9.25; 130 12.675,9.75; 131 12.675,10.25; 132 12.675,10.75 | smd 0.254 x 1.372: 45 -10.75,-12.675; 46 -10.25,-12.675; 47 -9.75,-12.675; 48 -9.25,-12.675; 49 -8.75,-12.675; 50 -8.25,-12.675; 51 -7.75,-12.675; 52 -7.25,-12.675; 53 -6.75,-12.675; 54 -6.25,-12.675; 55 -5.75,-12.675; 56 -5.25,-12.675; 57 -4.75,-12.675; 58 -4.25,-12.675; 59 -3.75,-12.675; 60 -3.25,-12.675; 61 -2.75,-12.675; 62 -2.25,-12.675; 63 -1.75,-12.675; 64 -1.25,-12.675; 65 -0.75,-12.675; 66 -0.25,-12.675; 67 0.25,-12.675; 68 0.75,-12.675; 69 1.25,-12.675; 70 1.75,-12.675; 71 2.25,-12.675; 72 2.75,-12.675; 73 3.25,-12.675; 74 3.75,-12.675; 75 4.25,-12.675; 76 4.75,-12.675; 77 5.25,-12.675; 78 5.75,-12.675; 79 6.25,-12.675; 80 6.75,-12.675; 81 7.25,-12.675; 82 7.75,-12.675; 83 8.25,-12.675; 84 8.75,-12.675; 85 9.25,-12.675; 86 9.75,-12.675; 87 10.25,-12.675; 88 10.75,-12.675; 133 10.75,12.675; 134 10.25,12.675; 135 9.75,12.675; 136 9.25,12.675; 137 8.75,12.675; 138 8.25,12.675; 139 7.75,12.675; 140 7.25,12.675; 141 6.75,12.675; 142 6.25,12.675; 143 5.75,12.675; 144 5.25,12.675; 145 4.75,12.675; 146 4.25,12.675; 147 3.75,12.675; 148 3.25,12.675; 149 2.75,12.675; 150 2.25,12.675; 151 1.75,12.675; 152 1.25,12.675; 153 0.75,12.675; 154 0.25,12.675; 155 -0.25,12.675; 156 -0.75,12.675; 157 -1.25,12.675; 158 -1.75,12.675; 159 -2.25,12.675; 160 -2.75,12.675; 161 -3.25,12.675; 162 -3.75,12.675; 163 -4.25,12.675; 164 -4.75,12.675; 165 -5.25,12.675; 166 -5.75,12.675; 167 -6.25,12.675; 168 -6.75,12.675; 169 -7.25,12.675; 170 -7.75,12.675; 171 -8.25,12.675; 172 -8.75,12.675; 173 -9.25,12.675; 174 -9.75,12.675; 175 -10.25,12.675; 176 -10.75,12.675
SMD_X_2_PADS = smd 1.9 x 1.1: P$1 0,1.25; P$2 0,-1.25
SMD_3225 = smd 1.6 x 1.4: 1 -1.2,-0.9; 2 1.2,-0.9; 3 1.2,0.9; 4 -1.2,0.9
CRYSTAL_ABM8G_ABR = smd 0.991 x 0.813: 1 -1.054,0.85; 2 -1.054,-0.85; 3 1.054,-0.85; 4 1.054,0.85

### Placement (x,y rotation side)
C1  35.96,72.48 270 top
C2  40.41,73.41 270 top
C3  27.82,73.13 270 top
C4  15.09,48.55 90 top
C5  51.2,55.35 90 top
C6  49.66,64.74 90 top
C7  31.19,74.12 0 top
C8  16.6,61.24 90 top
C9  31.72,40.07 270 top
C10  31.84,38.97 270 top
C11  34.73,40.07 90 top
C12  35.9,39.03 270 top
C13  37.83,39.5 180 top
C14  15.61,65.54 0 top
C15  16.3,54.77 90 top
C19  15.7,12.7 0 top
C20  19.25,12.7 0 top
C21  16.85,12.7 0 top
C23  16.3,59.75 90 top
C26  54,59.52 90 top
C28  38.39,41.06 90 top
C29  54.05,53.96 90 top
C31  41.07,41.4 0 top
C40  25.31,133.89 90 top
C41  21.4,132.59 270 top
C42  20.15,133.64 90 top
C43  14.87,133.81 270 top
C44  50.06,46.79 180 top
C45  16.3,57.09 90 top
C46  16.3,55.95 90 top
C47  17.7,112.85 0 top
C48  13.05,126.8 180 top
C49  31.28,121.42 90 top
C50  6.25,130.1 0 top
C51  25.3,131.95 270 top
C52  15.56,132.37 90 top
C53  31.29,122.6 90 top
C54  31.28,123.67 90 top
C55  11.95,122.52 180 top
C56  31.27,124.77 90 top
C57  8.25,130.1 180 top
C58  21.68,113.71 270 top
C203  112.09,12.69 0 top
C204  110.79,16.6 180 top
C205  111.84,17.85 0 top
C206  112.01,23.13 180 top
C207  91.05,19.7 270 top
C208  105,24.95 90 top
C209  99.62,6.72 0 top
C210  108.3,31.75 270 top
C211  110.15,12.7 180 top
C212  110.57,22.44 0 top
C213  100.8,6.71 0 top
C214  101.87,6.72 0 top
C215  100.72,26.05 90 top
C216  102.97,6.73 0 top
C217  108.3,29.75 90 top
C218  91.81,16.62 180 top
J1  55.3,73.3 0 top
J3  23.3,109.2 0 top
J4  8,115.8 90 top
J13  17.8,4 0 top
J24  87.4,14.7 270 top
J25  94,30 0 top
L2  21.85,12.2 180 top
LED2  3.65,13.3 180 top
R1  51.21,57.28 270 top
R2  51.22,56.32 270 top
R3  54,58.17 90 top
R4  36.41,42.75 270 top
R5  7.25,130.1 180 top
R12  8.46,13.3 90 top
R16  108.3,30.75 90 top
U1  21.2,123.1 270 top
U2  33,56.7 90 top
U13  101.3,16.8 180 top
X2  23.47,135.79 270 top
X3  31.8,37.26 90 top
X4  37.01,35.89 0 top
X14  113.99,14.53 180 top
Y1  18.35,136 0 top
Y12  114.2,19.65 270 top

### Tracks (layer width: path | path; a pad name or v marks a point on that pad's centre or on a via)
4/VBATT  (1 unrouted)
21/P207  (1 unrouted)
GND  (via drill 0.35)  (115 unrouted)
  Top 0.2: C5.P$2 51.82,55.37 R2.P$1 R1.P$1 51.84,57.3 | C45.P$1 15.75,57.04 | 15.71,55.9 C46.P$1 | U2.156 20.34,55.97 | C13.P$2 37.8,40.13 | X4.2 38.42,35.2 | 35.33,39.06 C12.P$2 | C9.P$2 31.05,40
  Top 0.254: C11.P$2 35.33,39.06
  other vias: 44.4,78.2
  pour Bottom (no thermals): 0,145.1 120,145.1 120,0 0,0
  pour Top (no thermals): 0,145.1 120,145.1 120,0 0,0
MISO
  Top 0.305: U2.132 22.25,70.15 19.3,73.1 19.3,101.6 24.2,106.5 34,106.5 | U1.48 25.01,116.53 25.94,115.6 30.9,115.6 33.46,113.04 J3.10 | U13.48 94.73,12.99 93.8,12.06 93.8,7.1 91.24,4.54 J24.10 | 34,106.5 72.4,106.5 78,100.9 78,6 79.46,4.54 J24.9 | J3.9 33.46,107.04 34,106.5
  Top 1.27: J3.10 J3.9 | J24.10 J24.9
MOSI  (via drill 0.35)
  Top 0.305: U2.131 22.75,71.55 21.1,73.2 21.1,100.2 25.7,104.8 v30.9,104.8 70.7,104.8 76.4,99.1 76.4,39.3 v76.4,7.1 | U1.47 24.5,115.8 25.7,114.6 29.3,114.6 30.92,112.98 J3.8 | U13.47 94,13.5 92.8,12.3 92.8,8.7 91.18,7.08 J24.8
  Top 1.27: J3.8 J3.7 | J24.8 J24.7
  Bottom 0.305: J3.7 30.92,104.82 v30.9,104.8 | J24.7 87.38,7.1 v76.4,7.1
N$2
  Top 0.254: C8.P$2 18.49,59.95 U2.148
N$3
  Top 0.254: C9.P$1 32.32,40.97 31.25,42.05 U2.19
N$4
  Top 0.508: LED2.1 R12.P$1
N$5
  Top 0.305: U1.40 20.95,116.33 22.25,115.03 22.25,113.74 C58.P$1
N$9
  Top 0.254: U2.62 47.55,54.45 48.45,55.35 C5.P$1
N$10
  Top 0.254: U2.64 47.45,55.45 48.32,56.32 R2.P$2
N$11
  Top 0.2: 45.9,55.95 U2.65
  Top 0.254: U2.65 47.05,55.95 48.38,57.27 R1.P$2
N$12
  Top 0.254: U2.27 35.25,43.31 R4.P$2
N$19
  Top 0.305: C218.P$1 92.37,16.06 94.53,17.05 U13.40
N$69  (1 unrouted)
N$70  (1 unrouted)
N$82  (1 unrouted)
N$83  (1 unrouted)
P5_05
  Top 0.2: U2.145
RESET
  Top 0.305: U2.67 46.95,56.95 48.17,58.17 R3.P$1
  Top 0.508: R3.P$1 C26.P$1 53.4,61.6 56.3,64.5 62.4,64.5 65.46,67.56 J1.9
  Route3 0.15: J1.9 65.46,70.36
RESET_A1  (1 unrouted)
  Top 0.305: J4.9 7.25,126.71 R5.P$1 C57.P$1 10.05,127.7 10.05,126.45 13.65,122.85 U1.25 | J25.9 104.91,30.75 R16.P$1 C217.P$1 105.9,27.95 104.65,27.95 101.05,24.35 U13.25
SCLK  (via drill 0.35)
  Top 0.305: U2.130 23.25,72.65 22.8,73.1 22.8,99.1 26.5,102.8 v28.3,102.8 69.4,102.8 74.5,97.7 v74.5,9.7 | J3.6 28.38,112.94 27.48,113.84 25.46,113.84 23.99,115.31 U1.46 | J24.6 91.14,9.62 92.04,10.52 92.04,12.54 93.51,14.01 U13.46
  Top 1.27: J3.6 J3.5 | J24.6 J24.5
  Bottom 0.305: J3.5 28.38,102.88 v28.3,102.8 | J24.5 74.5,9.62 v74.5,9.7
SSL0_A1_01  (via drill 0.35)
  Top 0.254: U2.129 23.75,75
  Top 0.305: U1.45 23.49,114.49 25.84,112.14 J3.4 | 23.75,75 23.75,97.45 v25.8,99.5
  Top 1.27: J3.4 J3.3
  Bottom 0.305: v25.8,99.5 25.8,109.16 J3.3
SSL0_A1_06  (via drill 0.35)
  Top 0.254: U2.122 27.25,70.45 29.9,73.1 29.9,78.6 32,80.7 68.9,80.7 72.54,77.06 72.54,12.22 v72.56,12.2
  Top 0.305: U13.45 92.69,14.51 90.34,12.16 J24.4
  Top 1.27: J24.4 J24.3
  Bottom 0.254: v72.56,12.2 87.36,12.2 J24.3
TCK  (2 unrouted)
  Top 0.254: U2.88 46.38,67.45
  Top 0.305: U2.88 59.65,67.45 62.92,70.72 J1.7 | U1.32 12.71,119.29 8.58,123.42 J4.7 | U13.32 97.49,25.29 101.62,29.42 J25.7
TDI  (2 unrouted)
  Top 0.305: U2.91 42.75,71.85 44.2,73.3 J1.1 | U1.35 18.41,115.41 17.6,114.6 11.1,114.6 9.9,115.8 J4.1 | U13.35 93.61,19.59 92.8,20.4 92.8,26.9 94,28.1 J25.1
TDO  (2 unrouted)
  Top 0.305: U2.90 43.25,70.65 44.3,71.7 57.2,71.7 57.84,72.34 J1.3 | U1.34 17.9,116 17.3,115.4 13.2,115.4 10.26,118.34 J4.3 | U13.34 94.2,20.1 93.6,20.7 93.6,24.8 96.54,27.74 J25.3
TMS  (2 unrouted)
  Top 0.15: 17.45,117.27 U1.33 | 95.47,20.55 U13.33
  Top 0.305: U2.89 43.75,69.95 44,70.2 58.5,70.2 60.38,72.08 J1.5 | U1.33 17.39,116.69 16.9,116.2 14.5,116.2 9.82,120.88 J4.5 | U13.33 94.89,20.61 94.4,21.1 94.4,23.5 99.08,28.18 J25.5
VCL0_A1  (1 unrouted)
  Top 0.254: U1.5 22.98,130.19 24.69,131.9 C51.P$2 | U13.5 108.36,15.05 110.1,13.31 C211.P$2
VCL_F(FLASH)
  Top 0.305: U2.112 32.25,70.16 31.19,71.22 C7.P$2
VDD  (via drill 0.35)  (14 unrouted)
  Top 0.2: U2.149 20.3,59.43 | U2.110 33.23,69.39 | C14.P$2 | 16.99,54.69 C15.P$2
  Top 0.254: U2.26 34.75,42.01 34.95,41.81 34.97,41.81 | 34.97,41.81 34.25,42.53 U2.25 | 37.77,41.72 37.77,41.08 C28.P$1 | 34.97,41.81 37.87,41.81 | U2.34 38.75,43.02 | 15.72,48.52 C4.P$2 | 17.04,54.64 16.99,54.69 C15.P$2 | 21.85,13.4 L2.2 23.15,13.3 | U2.123 26.74,69.39 26.74,71.84 26.9,72 | C50.P$1 R5.P$2 | 16.3,132.37 C52.P$2 | C55.P$1 11.28,121.92 10.5,122.7 10.5,123.8 9.6,124.7 3.4,124.7 | C210.P$1 R16.P$2 | 110.57,21.7 C212.P$2 | C215.P$1 100.12,26.72 100.9,27.5 102,27.5 102.9,28.4 102.9,34.6 | C6.P$1 49.06,65.14 50.22,66.3 61.6,66.3 64.2,68.9 64.2,79.3 | U13.38 94.43,18.07 92.8,19.7 C207.P$1 | U1.38 19.93,116.13 17.7,113.9 C47.P$1
  Top 0.305: U2.84 48.35,65.45 C6.P$1 | 18.1,64.95 U2.138 24.55,64.95 26.75,67.15 U2.123 | 18,64.95 15.62,64.95 C14.P$2 | U2.158 17.26,54.95 16.99,54.69 | 17.61,48.45 U2.171 | 17.6,48.45 15.79,48.45 15.72,48.52 | 26.9,72 27.2,72.3 27.2,73.1 C3.P$2 | U2.110 33.25,70.37 C1.P$2 35.36,74.76 36.44,75.84 40.4,75.84 | 13.3,120.83 C55.P$1 | U1.11 19.93,129.84 17.4,132.37 16.3,132.37 | U1.29 13.3,120.81 | C53.P$1 C49.P$1 30.68,120.88 29.6,120.31 U1.51 | C53.P$1 C54.P$1 | C54.P$1 C56.P$1 | U1.56 29.25,122.85 29.5,122.5 | 29.6,122.5 30.59,122.5 C53.P$1 | U1.57 28.85,123.35 29.16,123.66 C54.P$1 | U1.60 29.62,124.88 29.8,124.7 30.6,124.7 C56.P$1 | C47.P$1 7.77,113.45 5.44,115.78 | 7.3,132.4 7.25,132.35 R5.P$2 | U1.20 13.41,125.39 13.05,125.75 C48.P$1 12.3,126.2 10.8,127.7 10.8,135 10.95,135.15 | 3.4,124.7 2.1,124.7 1.8,125 | C56.P$1 30.67,126.17 30.8,126.3 | 43.65,132.85 43.7,132.9 | 47.2,135.5 47.35,135.65 | 85.45,133.15 85.5,133.2 | 89,135.8 89.15,135.95 | 99.03,24.7 C215.P$1 | U13.11 108.22,18.05 110.57,20.4 110.57,21.7 | U13.29 99.01,24.7 | C213.P$1 C209.P$1 99.08,7.32 98.51,8.4 U13.51 | C213.P$1 C214.P$1 | C214.P$1 C216.P$1 | U13.56 101.05,8.75 100.7,8.5 | 100.7,8.4 100.7,7.41 C213.P$1 | U13.57 101.55,9.15 101.86,8.84 C214.P$1 | U13.60 103.08,8.38 102.9,8.2 102.9,7.4 C216.P$1 | C207.P$1 91.65,30.23 93.98,32.56 | 110.6,30.7 110.55,30.75 R16.P$2 | U13.20 103.59,24.59 103.95,24.95 C208.P$1 104.4,25.7 105.9,27.2 113.2,27.2 113.35,27.05 | 102.9,34.6 102.9,35.9 103.2,36.2 | C216.P$1 104.37,7.33 104.5,7.2 | U2.149 18.15,59.45 17.85,59.75 C23.P$2 | U2.154 17.04,56.95 C45.P$2 | U2.155 18.75,56.45 18.25,55.95 C46.P$2 | C15.P$2 16.9,52.1 15.69,50.89 C4.P$2
  Top 0.305: 16.9,58.2 13.7,58.2 13,58.9 13,63.6 14.34,64.94 C14.P$2 | U2.97 39.75,73.35 C2.P$2 39.81,75.25 40.4,75.84 | 40.4,75.84 J1.2 | 37.87,41.81 38.58,42.52 | 38.58,42.52 38.75,42.7 38.75,43.02 | 38.58,42.52 39.1,42 C31.P$1 51.05,42 53.45,44.4 C29.P$1 | U2.48 50,47.45 C44.P$2 | U2.61 49.36,53.95 49.38,53.97
  Top 0.508: C15.P$2 C46.P$2 C45.P$2 16.9,58.2 C23.P$2 | 49.38,53.97 C29.P$1 53.45,55.15 54.6,56.3 R3.P$2 | L2.2 18.95,13.3 | C20.P$1 17.15,13.3 | C21.P$1 C19.P$1 v11.9,13.3 R12.P$2
  Top 0.813: J1.4 57.84,77.94 59.2,79.3 64.2,79.3 67.6,79.3 70.8,76.1 70.8,61.4 67.2,57.8 56.1,57.8 54.6,56.3
  Top 1.016: v11.9,13.3 | J4.2 J4.4 | 5.43,118.37 J4.4 | J4.4 3.16,118.34 1.8,119.7 1.8,125 1.8,130.1 4.1,132.4 7.3,132.4 8.2,132.4 10.95,135.15 14.9,139.1 27.2,139.1 30.8,135.5 | 30.8,126.3 30.8,135.5 | J25.2 J25.4 | 96.57,32.57 J25.4 | J25.4 96.54,34.84 97.9,36.2 103.2,36.2 108.3,36.2 110.6,33.9 110.6,30.7 110.6,29.8 113.35,27.05 117.3,23.1 | 104.5,7.2 110.3,7.2 | 110.3,7.2 113.7,7.2 117.3,10.8 117.3,23.1 | 30.8,135.5 37.9,135.5 40.5,132.9 43.7,132.9 44.6,132.9 47.35,135.65 51.3,139.6 63.6,139.6 67.2,136 79.5,136 82.3,133.2 85.5,133.2 86.4,133.2 89.15,135.95 93.1,139.9 105.4,139.9 109,136.3 109,130.6 113.5,130.6 117.3,126.8 117.3,23.1 | L2.2 37.1,13.3 48.6,1.8 104.9,1.8 110.3,7.2
  Top 1.27: 55.26,75.8 J1.2 J1.4 | 5.44,115.78 J4.2 | 93.98,32.56 J25.2
  Bottom 1.016: v11.9,13.3
VDDIN
  Top 1.016: J13.P$2 21.61,10.86 L2.1
XCIN  (2 unrouted)
  Top 0.254: U2.20 31.74,44.02 31.74,42.31 33.05,41.01 33.05,39.65 32.44,39.05 | X3.P$1 31.53,37.26 31.84,37.57 31.84,38.17 32.44,38.77
XCIN_A1  (1 unrouted)
  Top 0.254: 22.47,129 U1.6 | 107.2,15.53 U13.6
  Top 0.305: X2.P$1 C40.P$1 24.71,133.77 23.12,132.18 23.12,131.55 22.47,130.9 22.47,129 | X14.P$1 C203.P$1 111.97,13.29 110.38,14.88 109.75,14.88 109.1,15.53 107.2,15.53
XCOUT  (1 unrouted)
  Top 0.254: U2.21 32.25,42.6 34.13,40.72 C11.P$1 34.13,38.34 33.15,37.35
XCOUT_A1  (1 unrouted)
  Top 0.152: X2.P$2 22.07,135.94 22.07,136.53 | X14.P$2 114.14,15.94 114.73,15.94
  Top 0.254: U1.7 21.96,132.55 C41.P$1 | U13.7 110.75,16.04 C204.P$1
  Top 0.305: C41.P$1 22,136.47 22.07,136.53 | C204.P$1 114.67,16 114.73,15.94
XTAL1  (3 unrouted)
  Top 0.254: U2.23 33.25,42.3 34.75,40.8 35.75,40.8 36.5,40.05 | 36.5,39 36.5,38.48 36.99,38 36.99,35.4 | 36.95,35.35 36.58,34.99 35.9,34.99
  Top 0.305: 36.5,40.05 C12.P$1
XTAL1_A1  (1 unrouted)
  Top 0.152: 19.55,133.6 C42.P$1 | 111.8,18.45 C205.P$1
  Top 0.254: 19.55,133.4 19.55,133.6 | 111.6,18.45 111.8,18.45
  Top 0.305: U1.9 20.95,131 19.55,132.4 19.55,133.4 | Y1.3 19.55,135 C42.P$1 | 111.6,18.45 111.4,18.65 110.77,18.65 109.17,17.05 U13.9 | Y12.3 113.2,18.45 C205.P$1
XTAL2  (1 unrouted)
  Top 0.254: X4.3 38.1,36.9 38.1,38.62 37.83,38.88 C13.P$1 37.66,39.05 | 33.75,44 33.75,42.42 34.82,41.35 36,41.35 37.11,40.24 37.11,39.61
  Top 0.305: 37.11,39.61 37.82,38.9 C13.P$1
XTAL2_A1  (1 unrouted)
  Top 0.305: Y1.1 16.1,136.85 15.47,136.22 C43.P$1 17,133.81 20.44,130.37 U1.10 | Y12.1 115.05,21.9 114.42,22.53 C206.P$1 112.01,20.9 108.67,17.56 U13.10

### Text on the board
tPlace: 12.0 MHz | 12.0 MHz | 32.768KHz | 12.0 MHz | 32.768KHz | 32.768KHz | JTAG | Reset | TCK | TMS | TDO | TDI | 12.0 MHz | 32.768KHz | 12.0 MHz | 32.768KHz | JTAG | Reset | TDI | TDO | TMS | TCK | 12.0 MHz | 32.768KHz